# Altium project STM32F746_AppBoard.PrjPCB (part 1 of 2)
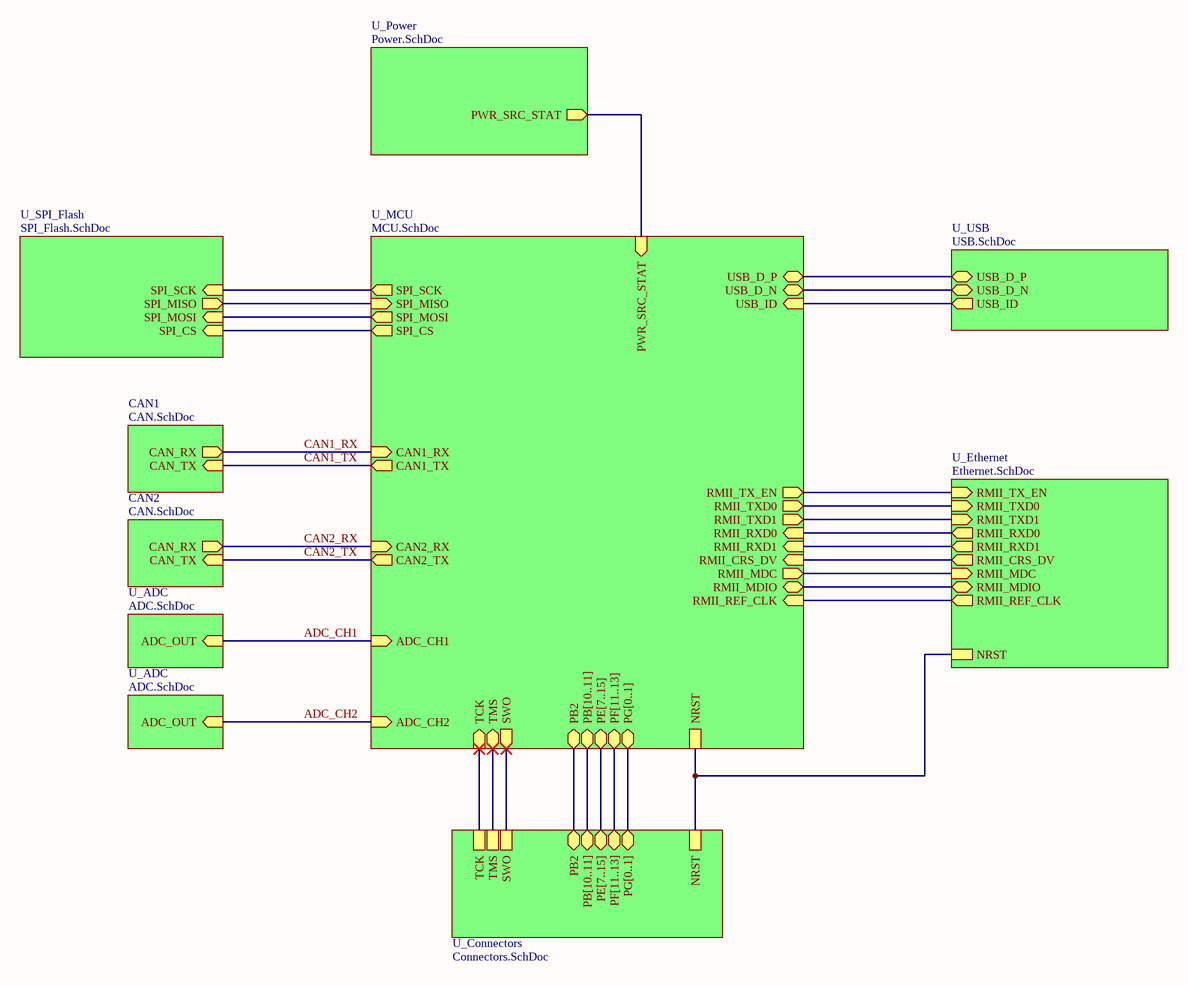
[diagram p0: Top.SchDoc]
9 sheets, 187 parts. Net scope: hierarchical (ports join the sheet entries above them; power ports are global).
Board file: STM32F746_AppBoard.PcbDoc
Sheets:
  Top.SchDoc
    U_Connectors = Connectors.SchDoc
    U_Ethernet = Ethernet.SchDoc
    U_MCU = MCU.SchDoc
    U_USB = USB.SchDoc
    U_SPI_Flash = SPI_Flash.SchDoc
    U_Power = Power.SchDoc
    CAN1 = CAN.SchDoc
    CAN2 = CAN.SchDoc
    U_ADC = ADC.SchDoc
    U_ADC = ADC.SchDoc

## Sheet Top.SchDoc: Top
size 431 x 279 mm; Author: Alberto Marrone, Christian Schmitz, Leo Walter; DrawnBy: Alberto Marrone, Christian Schmitz, Leo Walter; Engineer: Alberto Marrone, Christian Schmitz, Leo Walter; Revision: V1.0; SheetNumber: 1; Project: PCB Design Final Project

### Sub-sheets
CAN1 = CAN.SchDoc: CAN_TX (in), CAN_RX (out)
CAN2 = CAN.SchDoc: CAN_TX (in), CAN_RX (out)
U_ADC = ADC.SchDoc: ADC_OUT (in)
U_ADC = ADC.SchDoc: ADC_OUT (in)
U_Connectors = Connectors.SchDoc: PF[11..13] (bidir), PB[10..11] (bidir), PE[7..15] (bidir), TCK, TMS, SWO, NRST, PB2 (bidir), PG[0..1] (bidir)
U_Ethernet = Ethernet.SchDoc: RMII_TXD0 (in), RMII_TX_EN (in), RMII_RXD0 (out), RMII_REF_CLK (out), RMII_CRS_DV (out), RMII_MDC (in), RMII_MDIO (bidir), NRST, RMII_TXD1 (in), RMII_RXD1 (out)
U_MCU = MCU.SchDoc: RMII_TXD0 (out), RMII_TX_EN (out), RMII_RXD0 (in), RMII_REF_CLK (in), RMII_CRS_DV (in), RMII_MDC (out), RMII_MDIO (bidir), RMII_TXD1 (out), RMII_RXD1 (in), SPI_SCK (out), SPI_MOSI (out), SPI_CS (out), SPI_MISO (in), USB_ID (in), PWR_SRC_STAT (in), CAN2_RX (in), CAN2_TX (out), SWO (out), TMS (bidir), TCK (in), NRST, USB_D_N (bidir), USB_D_P (bidir), CAN1_TX (out), CAN1_RX (in), ADC_CH1 (in), ADC_CH2 (in), PB2 (bidir), PB[10..11] (bidir), PF[11..13] (bidir), PE[7..15] (bidir), PG[0..1] (bidir)
U_Power = Power.SchDoc: PWR_SRC_STAT (out)
U_SPI_Flash = SPI_Flash.SchDoc: SPI_SCK (in), SPI_MOSI (in), SPI_MISO (out), SPI_CS (in)
U_USB = USB.SchDoc: USB_ID (out), USB_D_N (bidir), USB_D_P (bidir)

### Nets
ADC_CH1: sheet U_MCU/ADC_CH1, sheet U_ADC/ADC_OUT
ADC_CH2: sheet U_MCU/ADC_CH2, sheet U_ADC/ADC_OUT
CAN1_RX: sheet U_MCU/CAN1_RX, sheet CAN1/CAN_RX
CAN1_TX: sheet U_MCU/CAN1_TX, sheet CAN1/CAN_TX
CAN2_RX: sheet U_MCU/CAN2_RX, sheet CAN2/CAN_RX
CAN2_TX: sheet U_MCU/CAN2_TX, sheet CAN2/CAN_TX
NRST: sheet U_Connectors/NRST, sheet U_Ethernet/NRST, sheet U_MCU/NRST
PB2: sheet U_Connectors/PB2, sheet U_MCU/PB2
USB_D_N: sheet U_MCU/USB_D_N, sheet U_USB/USB_D_N
USB_D_P: sheet U_MCU/USB_D_P, sheet U_USB/USB_D_P
NetCN1_4: sheet U_MCU/USB_ID, sheet U_USB/USB_ID
NetP1_2: sheet U_Connectors/TMS, sheet U_MCU/TMS
NetP1_4: sheet U_Connectors/TCK, sheet U_MCU/TCK
NetP1_7: sheet U_Connectors/SWO, sheet U_MCU/SWO
NetR15_2: sheet U_Ethernet/RMII_RXD0, sheet U_MCU/RMII_RXD0
NetR16_2: sheet U_Ethernet/RMII_RXD1, sheet U_MCU/RMII_RXD1
NetR23_2: sheet U_Ethernet/RMII_CRS_DV, sheet U_MCU/RMII_CRS_DV
NetR24_1: sheet U_Ethernet/RMII_MDIO, sheet U_MCU/RMII_MDIO
NetR29_2: sheet U_Ethernet/RMII_REF_CLK, sheet U_MCU/RMII_REF_CLK
NetR50_2: sheet U_MCU/PWR_SRC_STAT, sheet U_Power/PWR_SRC_STAT
NetU1_1: sheet U_MCU/SPI_SCK, sheet U_SPI_Flash/SPI_SCK
NetU1_3: sheet U_MCU/SPI_CS, sheet U_SPI_Flash/SPI_CS
NetU1_4: sheet U_MCU/SPI_MISO, sheet U_SPI_Flash/SPI_MISO
NetU1_5: sheet U_MCU/SPI_MOSI, sheet U_SPI_Flash/SPI_MOSI
NetU1_27: sheet U_Ethernet/RMII_MDC, sheet U_MCU/RMII_MDC
NetU1_74: sheet U_Ethernet/RMII_TXD1, sheet U_MCU/RMII_TXD1
NetU1_126: sheet U_Ethernet/RMII_TX_EN, sheet U_MCU/RMII_TX_EN
NetU1_128: sheet U_Ethernet/RMII_TXD0, sheet U_MCU/RMII_TXD0

### Buses and harness runs
bus sheet U_Connectors/PB[10..11] = sheet U_MCU/PB[10..11]
bus sheet U_Connectors/PE[7..15] = sheet U_MCU/PE[7..15]
bus sheet U_Connectors/PF[11..13] = sheet U_MCU/PF[11..13]
bus sheet U_Connectors/PG[0..1] = sheet U_MCU/PG[0..1]

### Notes on the sheet
- DWG. NO.
- REV.
- SHT.
- THIS DOCUMENT AND THE DATA DISCLOSED HEREIN OR HEREWITH IS THE PROPERTY OF ALTIUM LIMITED AND MAY BE FREELY DISTRIBUTED IN WHOLE. NO RIGHTS ARE RESERVED OR EXPRESS OR IMPLIED WARANTEE GIVEN.
- REVISION
- DESCRIPTION
- DATE
- APPROVED
- ENG:
- APPROVALS
- PROJECT
- DSN:
- CHK:
- REFERENCE DOCUMENTS
- PROJECT REVISION:
- TITLE
- DOCUMENT REVISION:
- DESIGN ITEM:
- BOM:
- FAB DWG:
- PCB DWG:
- ASSY DWG:
- SCALE:
- SIZE
- B
- CAGE CODE
- FILE NAME
- DWG NO.
- SHEET
- OF
- REV

## Sheet Connectors.SchDoc: Connectors
size 431 x 279 mm; Author: Alberto Marrone, Christian Schmitz, Leo Walter; DrawnBy: Alberto Marrone, Christian Schmitz, Leo Walter; Engineer: Alberto Marrone, Christian Schmitz, Leo Walter; Revision: V1.0; SheetNumber: 8; Project: PCB Design Final Project
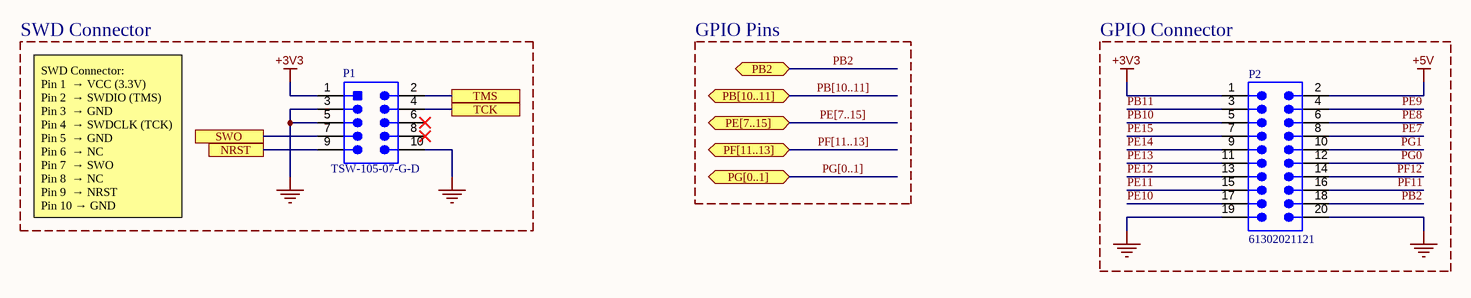
[diagram p1: Connectors.SchDoc]

### Parts
P1  TSW-105-07-G-D  [SMTC-TSW-105-07-G-D_V]
P2  61302021121  [61302021121]

### Blocks framed on the sheet
SWD Connector: P1
GPIO Connector: P2

### Ports
NRST, PB2 (bidir), PB[10..11] (bidir), PE[7..15] (bidir), PF[11..13] (bidir), PG[0..1] (bidir), SWO, TCK, TMS

### Nets
+3V3: P1.1 P2.1
+5V: P2.2
GND: P1.3 P1.5 P1.10 P2.19 P2.20
NRST: P1.9 ; port NRST
PB2: P2.18 ; port PB2
PB10: P2.5
PB11: P2.3
PE7: P2.8
PE8: P2.6
PE9: P2.4
PE10: P2.17
PE11: P2.15
PE12: P2.13
PE13: P2.11
PE14: P2.9
PE15: P2.7
PF11: P2.16
PF12: P2.14
PG0: P2.12
PG1: P2.10
NetP1_2: P1.2 ; port TMS
NetP1_4: P1.4 ; port TCK
NetP1_7: P1.7 ; port SWO

Not connected (* = marked no-connect by the designer): P1 6* 8*

### Buses and harness runs
bus PB[10..11] = port PB[10..11]
bus PE[7..15] = port PE[7..15]
bus PF[11..13] = port PF[11..13]
bus PG[0..1] = port PG[0..1]

### Notes on the sheet
- GPIO Pins
- SWD Connector:
  Pin 1  → VCC (3.3V)
  Pin 2  → SWDIO (TMS)
  Pin 3  → GND
  Pin 4  → SWDCLK (TCK)
  Pin 5  → GND
  Pin 6  → NC
  Pin 7  → SWO
  Pin 8  → NC
  Pin 9  → NRST
  Pin 10 → GND
- DWG. NO.
- REV.
- SHT.
- THIS DOCUMENT AND THE DATA DISCLOSED HEREIN OR HEREWITH IS THE PROPERTY OF ALTIUM LIMITED AND MAY BE FREELY DISTRIBUTED IN WHOLE. NO RIGHTS ARE RESERVED OR EXPRESS OR IMPLIED WARANTEE GIVEN.
- REVISION
- DESCRIPTION
- DATE
- APPROVED
- ENG:
- APPROVALS
- PROJECT
- DSN:
- CHK:
- REFERENCE DOCUMENTS
- PROJECT REVISION:
- TITLE
- DOCUMENT REVISION:
- DESIGN ITEM:
- BOM:
- FAB DWG:
- PCB DWG:
- ASSY DWG:
- SCALE:
- SIZE
- B
- CAGE CODE
- FILE NAME
- DWG NO.
- SHEET
- OF
- REV

### Library data of the parts
P1 = CMP-2000-07330-1: Post Terminal Strip Assembly, Pitch 2.54 mm, 2 x 5 Position, Height 8.58 mm, Tail Length 2.54 mm, -55 to 125 degC, RoHS, Bulk; Manufacturer: Samtec-Inc.; Connector Type: Header,Unshrouded; Number of Positions Loaded: All; Pitch: 0.100"(2.54mm); Number of Positions: 10; Package Reference: TSW-105-07-G-D; Mounting Technology: ThroughHole; Datasheet URL: http://suddendocs.samtec.com/prints/tsw-xxx-xx-xxx-x-xx-xxx-mkt.pdf; Termination: Solder; Packaging: Bulk; Number of Rows: 2; Contact Finish: Gold; Mounting Type: ThroughHole; Features: -; Color: Black; Category: Connectors,Interconnects; Family: RectangularConnectors-Headers,MalePins; Manufacturer URL: http://www.samtec.com/; Series: TSW; Fastening Type: -; Package URL: http://suddendocs.samtec.com/prints/tsw-xxx-xx-x-x-xx-xxx-footprint.pdf; Row Spacing: 0.100"(2.54mm); Contact Mating Length: 0.230"(5.84mm); Contact Finish Thickness: 10µin(0.25µm); Contact Type: MalePin; Package Description: Male Header, Pitch 2.54 mm, 2 x 5 Position, Height 8.58 mm, Tail Length 2.54 mm; Datasheet Version: Rev. DO, 08/1988
P2 = CMP-1502-01104-4: THT Vertical Pin Header WR-PHD, Pitch 2.54 mm, Dual Row, 20 pins; Connector Type: Male Pin; Current Rating: 3A; Number of Contacts: 20; Gender: Male; Contact Resistance: 20mΩ; Pitch: 2.54mm; Operating Supply Voltage: 250V; Color: Black; Contact Mating Length: 5.9944mm; Termination: Solder; Packaging: Bulk; Lead Pitch: 2.54mm; Height: 8.89mm; Orientation: Vertical; Min Operating Temperature: -40°C; Max Operating Temperature: 105°C; Number of Positions: 20; Mount: Through Hole; RoHS: Compliant; Number of Pins: 20; Voltage Rating: 250V; Number of Rows: 2; Contact Plating: Gold; Row Spacing: 2.54mm; Contact Material: Gold

## Sheet Ethernet.SchDoc: Ethernet
size 431 x 279 mm; Author: Alberto Marrone, Christian Schmitz, Leo Walter; DrawnBy: Alberto Marrone, Christian Schmitz, Leo Walter; Engineer: Alberto Marrone, Christian Schmitz, Leo Walter; Revision: V1.0; SheetNumber: 7; Project: PCB Design Final Project
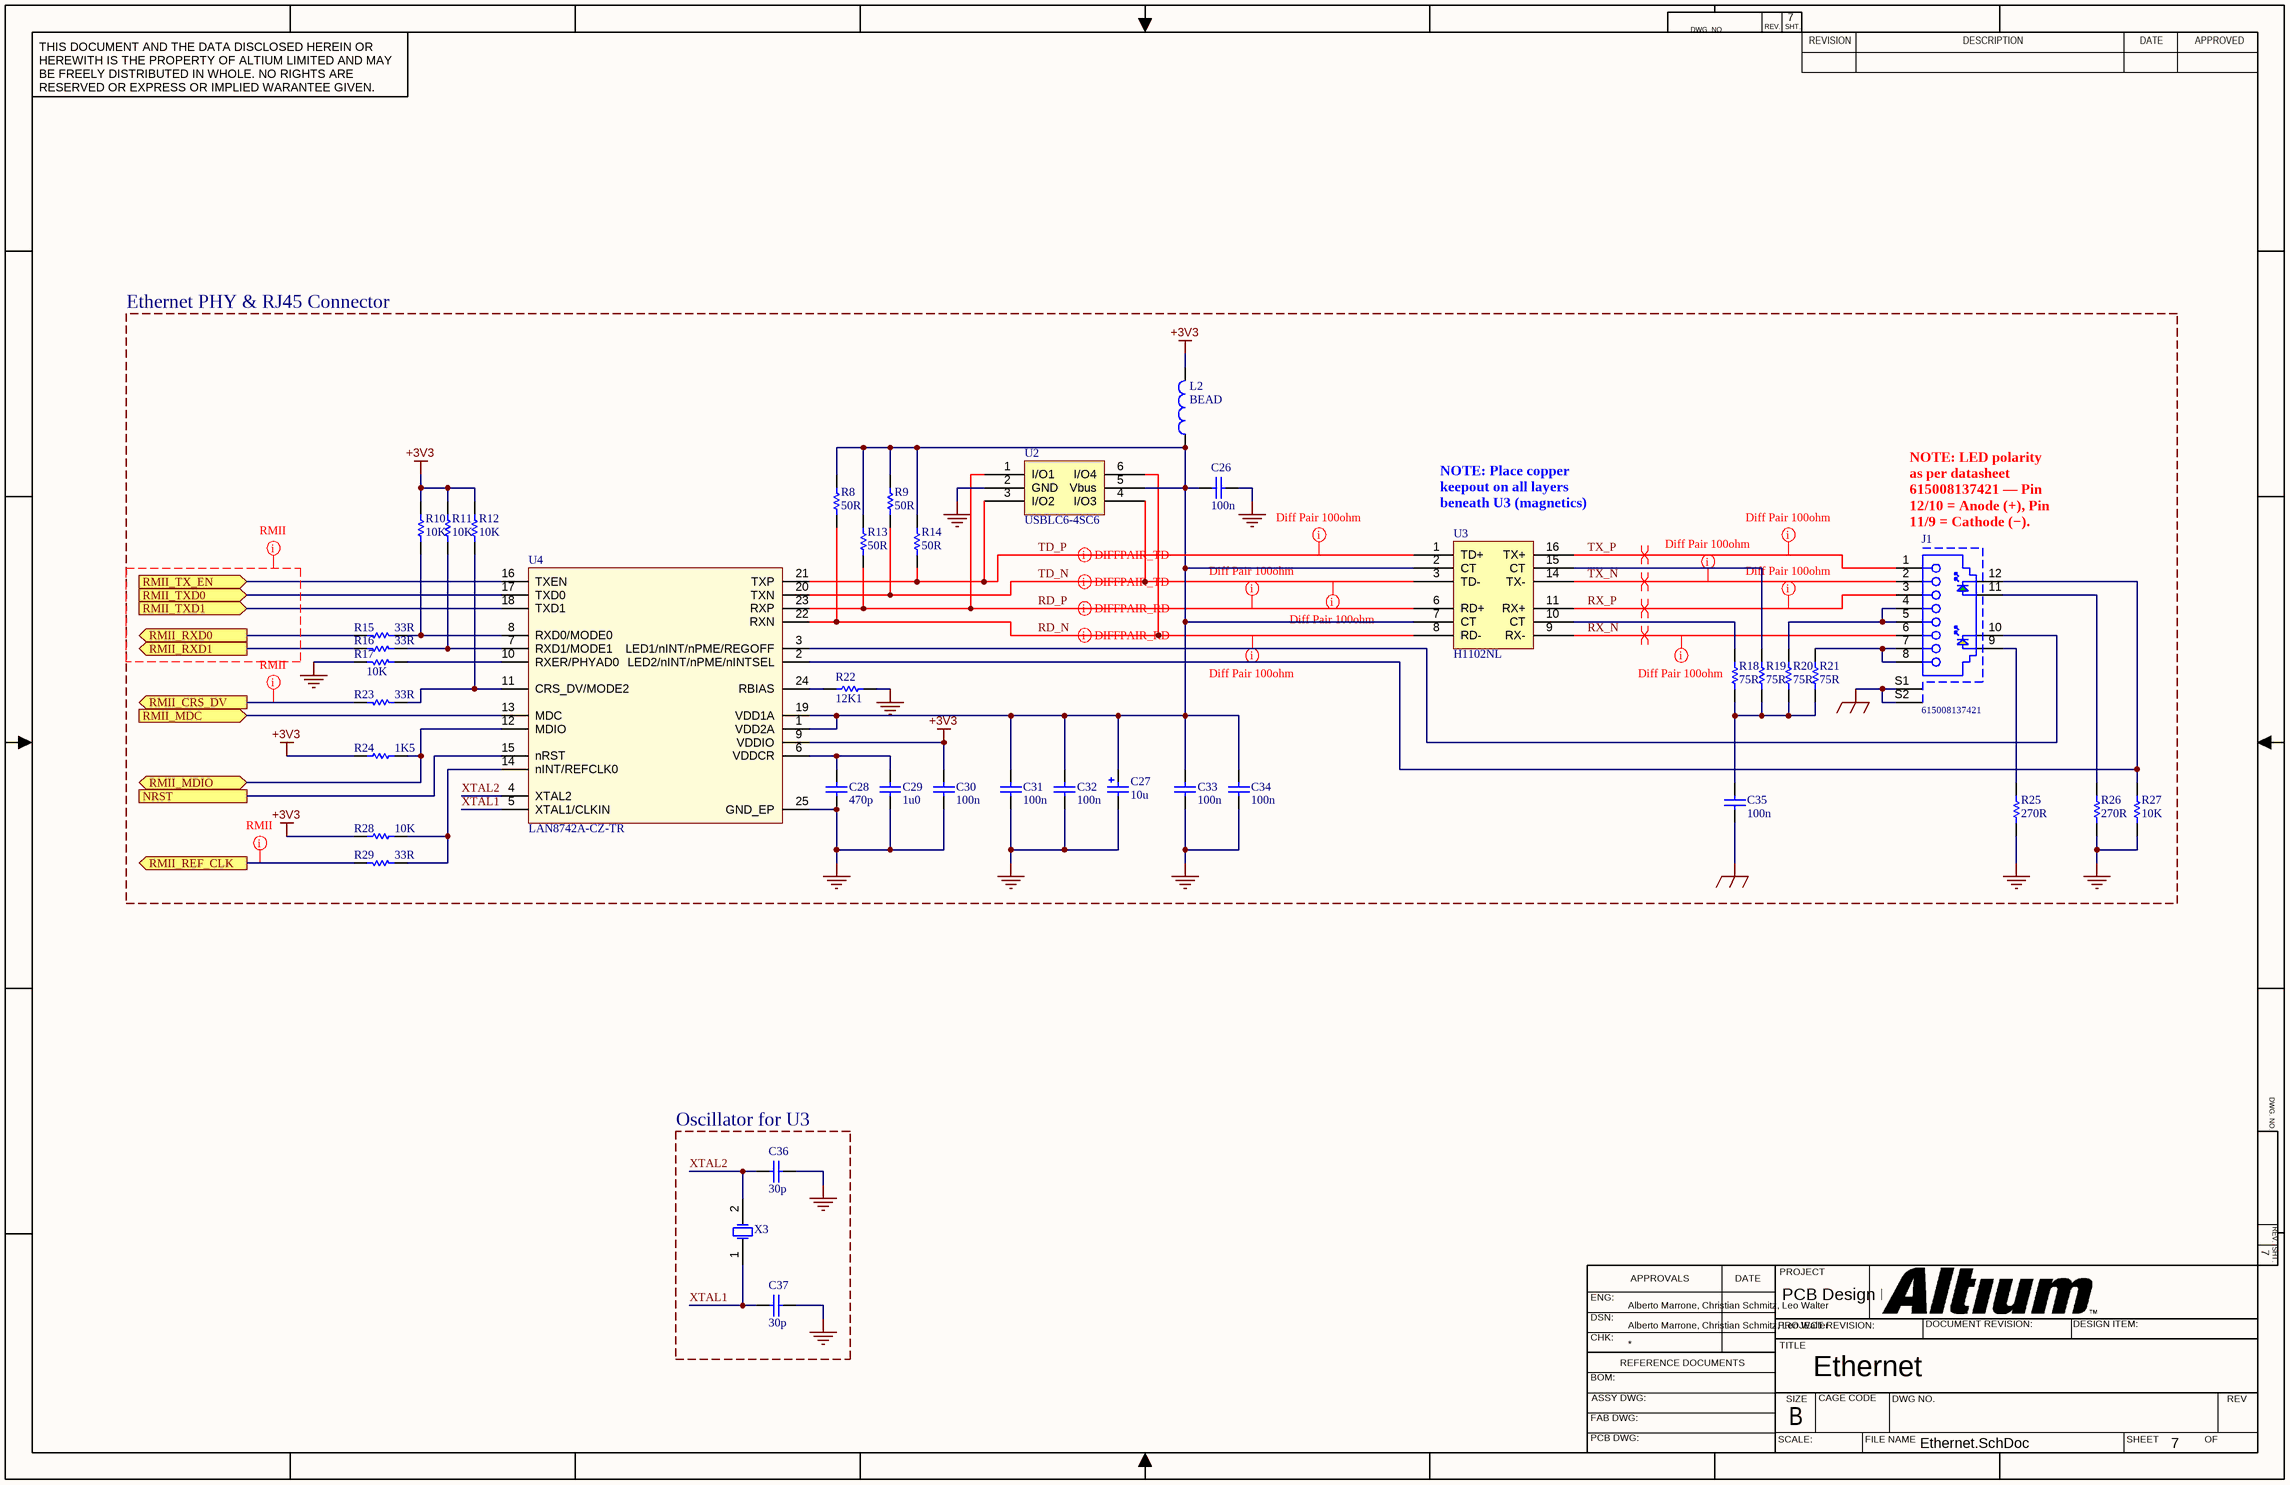
[diagram p2: Ethernet.SchDoc]

### Parts
C26  100n  [0603C]
C27  10u  [TAN-B]
C28  470p  [0603C]
C29  1u0  [0603C]
C30  100n  [0603C]
C31  100n  [0603C]
C32  100n  [0603C]
C33  100n  [0603C]
C34  100n  [0603C]
C35  100n  [0603C]
C36  30p  [0603C]
C37  30p  [0603C]
J1  615008137421  [615008137421]
L2  BEAD  [0603L]
R8  50R  [0603R]
R9  50R  [0603R]
R10  10K  [0603R]
R11  10K  [0603R]
R12  10K  [0603R]
R13  50R  [0603R]
R14  50R  [0603R]
R15  33R  [0603R]
R16  33R  [0603R]
R17  10K  [0603R]
R18  75R  [0603R]
R19  75R  [0603R]
R20  75R  [0603R]
R21  75R  [0603R]
R22  12K1  [0603R]
R23  33R  [0603R]
R24  1K5  [0603R]
R25  270R  [0603R]
R26  270R  [0603R]
R27  10K  [0603R]
R28  10K  [0603R]
R29  33R  [0603R]
U2  USBLC6-4SC6  [SOT23-6L]
U3  H1102NL  [Transformer]
U4  LAN8742A-CZ-TR  [QFN24_0R5_4X4]
X3  ECS-250-12-30Q-JES-TR  [XTAL_2SM_5R0X3R2]  (value not drawn)

### Blocks framed on the sheet
Ethernet PHY & RJ45 Connector: C26-C35 J1 L2 R8-R29 U2-U4
Oscillator for U3: C36 C37 X3

### Ports
NRST, RMII_CRS_DV (out), RMII_MDC (in), RMII_MDIO (bidir), RMII_REF_CLK (out), RMII_RXD0 (out), RMII_RXD1 (out), RMII_TX_EN (in), RMII_TXD0 (in), RMII_TXD1 (in)

### Nets
+3V3: C30.2 L2.2 R10.1 R11.1 R12.1 R24.2 R28.1 U4.9(VDDIO)
EGND: C35.1 J1.S1 J1.S2
GND: C26.1 C27.2 C28.1 C29.2 C30.1 C31.1 C32.1 C33.1 C34.1 C36.2 C37.2 R17.2 R22.2 R25.2 R26.2 R27.2 U2.2(GND) U4.25(GND_EP)
NRST: U4.15(nRST) ; port NRST
RD_N: R8.1 U2.6(I/O4) U3.8(RD-) U4.22(RXN)
RD_P: R13.1 U2.1(I/O1) U3.6(RD+) U4.23(RXP)
RX_N: J1.6 U3.9(RX-)
RX_P: J1.3 U3.11(RX+)
TD_N: R9.1 U2.4(I/O3) U3.3(TD-) U4.20(TXN)
TD_P: R14.1 U2.3(I/O2) U3.1(TD+) U4.21(TXP)
TX_N: J1.2 U3.14(TX-)
TX_P: J1.1 U3.16(TX+)
XTAL1: C37.1 U4.5(XTAL1/CLKIN) X3.1(OSC1)
XTAL2: C36.1 U4.4(XTAL2) X3.2(OSC2)
NetC26_2: C26.2 C27.1 C31.2 C32.2 C33.2 C34.2 L2.1 R8.2 R9.2 R13.2 R14.2 U2.5(Vbus) U3.2(CT) U3.7(CT) U4.1(VDD2A) U4.19(VDD1A)
NetC28_2: C28.2 C29.1 U4.6(VDDCR)
NetC35_2: C35.2 R18.1 R19.1 R20.1 R21.1
NetJ1_4: J1.4 J1.5 R20.2
NetJ1_7: J1.7 J1.8 R21.2
NetJ1_9: J1.9 R25.1
NetJ1_10: J1.10 U4.3(LED1/nINT/nPME/REGOFF)
NetJ1_11: J1.11 R26.1
NetJ1_12: J1.12 R27.1 U4.2(LED2/nINT/nPME/nINTSEL)
NetR10_2: R10.2 R15.1 U4.8(RXD0/MODE0)
NetR11_2: R11.2 R16.1 U4.7(RXD1/MODE1)
NetR12_2: R12.2 R23.1 U4.11(CRS_DV/MODE2)
NetR15_2: R15.2 ; port RMII_RXD0
NetR16_2: R16.2 ; port RMII_RXD1
NetR17_1: R17.1 U4.10(RXER/PHYAD0)
NetR18_2: R18.2 U3.10(CT)
NetR19_2: R19.2 U3.15(CT)
NetR22_1: R22.1 U4.24(RBIAS)
NetR23_2: R23.2 ; port RMII_CRS_DV
NetR24_1: R24.1 U4.12(MDIO) ; port RMII_MDIO
NetR28_2: R28.2 R29.1 U4.14(nINT/REFCLK0)
NetR29_2: R29.2 ; port RMII_REF_CLK
NetU1_27: U4.13(MDC) ; port RMII_MDC
NetU1_74: U4.18(TXD1) ; port RMII_TXD1
NetU1_126: U4.16(TXEN) ; port RMII_TX_EN
NetU1_128: U4.17(TXD0) ; port RMII_TXD0

### Layout directives
differential pair: RD_N, RD_P, RX_N, RX_P, TD_N, TD_P, TX_N, TX_P
net class ETH_Diff: RD_N, RD_P, RX_N, RX_P, TD_N, TD_P, TX_N, TX_P
net class RMII: (no net found under the mark), NetR23_2, NetR29_2

### Notes on the sheet
- (near U3) NOTE: Place copper keepout on all layers beneath U3 (magnetics)
- (near J1) NOTE: LED polarity as per datasheet 615008137421 — Pin 12/10 = Anode (+), Pin 11/9 = Cathode (−). Symbol shows reversed polarity.
- DWG. NO.
- REV.
- SHT.
- THIS DOCUMENT AND THE DATA DISCLOSED HEREIN OR HEREWITH IS THE PROPERTY OF ALTIUM LIMITED AND MAY BE FREELY DISTRIBUTED IN WHOLE. NO RIGHTS ARE RESERVED OR EXPRESS OR IMPLIED WARANTEE GIVEN.
- REVISION
- DESCRIPTION
- DATE
- APPROVED
- ENG:
- APPROVALS
- PROJECT
- DSN:
- CHK:
- REFERENCE DOCUMENTS
- PROJECT REVISION:
- TITLE
- DOCUMENT REVISION:
- DESIGN ITEM:
- BOM:
- FAB DWG:
- PCB DWG:
- ASSY DWG:
- SCALE:
- SIZE
- B
- CAGE CODE
- FILE NAME
- DWG NO.
- SHEET
- OF
- REV

### Library data of the parts
C26 C30-C35 = Cap: Capacitor; Dielectric: X7R; Published: 8-Jun-2000; Revision: July-2002: Re-released for DXP Platform.; Publisher: Altium Limited; Value: 100n
C27 = Cap Pol1: Tantalum Capacitor; Voltage Rating: 25V; Published: 8-Jun-2000; Revision: July-2002: Re-released for DXP Platform.; Publisher: Altium Limited; Value: 10u
C28 C36 C37 = Capacitor_ST: Capacitor 0402 / 0603 / 0805; Revision: July-2002: Re-released for DXP Platform.
  C28: Value: 470p
  C36 C37: Value: 30p
C29 = CAP SMD 0603  X5R 1µF 25V 10%: Capacitor; Voltage Rating: 25V; Tolerance: 10%; Dielectric: X5R; Manufacturer: *; Manufacturer P/N: *; Order code Farnell: 1288202RL; Value: 1u0; Power: *; Temperature  Factor: *; Temperature Max: +125°C; Temperature Min: -55°C; STS Code: *
J1 = CMP-1502-01697-1: Modular Jack WR-MJ, Tab Up, Shielded, with LED and EMI Panel Finger, Horizontal Entry, THT, 8P8C; Manufacturer: Wurth Elektronik; Compliance: Leadfree/RoHS; Withstanding Voltage: 1000VAC; Port: 1x1; Contact Resistance: 20mOhm; Rated Current: 1.5A; Working Voltage: 120VAC; Manufacturer URL: http://www.we-online.de; Mounting Technology: THT; Entrance: Horizontal; Datasheet URL: https://katalog.we-online.de/em/datasheet/615008137421.pdf; Packaging: Tray; Package Reference: 615008137421; Publisher: WurthElektronik; Operating Temperature: -40to85degC; Part Number: 615008137421; Pin Number: 8P8C
L2 = Inductor: Value: 100uH; Published: 8-Jun-2000; Revision: July-2002: Re-released for DXP Platform.; Publisher: Altium Limited
R8 R9 R13 R14 = Res_50_1%_0603: Resistor,50,0603,1%,YAGEO; Manuf_Part_1: RC0402FR-0750RL; Value: 50R; Manuf_1: YAGEO; Order: *; ECCN_US/EU: n/a; Distrib: FARNELL
R10-R12 R17 R27 R28 = res1: Resistor; Published: 8-Jun-2000; Revision: July-2002: Re-released for DXP Platform.; Publisher: Altium Limited; Value: 10K
R15 R16 R23 R29 = res1: Resistor; Tolerance: 1%; Published: 8-Jun-2000; Revision: July-2002: Re-released for DXP Platform.; Publisher: Altium Limited; Value: 33R
R18-R21 = Res_75_1%_0603: Resistor; Manuf_Part_1: RC0402FR-0750RL; Manuf_1: YAGEO; Tolerance: 1%; Value: 75R; Order: *; ECCN_US/EU: n/a; Distrib: FARNELL
R22 = Res_12K1_1%_0603: Resistor,12K1,0603,1%,VISHAY; Manuf_Part_1: MCT 0603-50 1% P5 12K1; Order: 2325243; Value: 12K1; ECCN_US/EU: n/a; Manuf_1: VISHAY; Distrib: FARNELL
R24 = Res_1K5_1%_0402: Resistor,1K5,0402,1%,YAGEO; Manuf_Part_1: RC0402FR-071K5L; Value: 1K5; Manuf_1: YAGEO; Order: RC0402FR-071K5L; ECCN_US/EU: n/a; Distrib: FARNELL
R25 R26 = Resistor_ST: Resistor 0402 / 0603 / 0805; Value: 270R
U3 = KMS-1102NL: replaces the KMS-1102NL
U4 = LAN8742A-CZ-TR: LAN8742A-CZ-TR - Small Footprint RMII 10/100 Ethernet, Transceiver with HP Auto-MDIX and flexPWR Technology SQFN-24; Manuf_1: MICROCHIP; Order: LAN8742A-CZ-TR; Manuf_Part_1: LAN8742A-CZ-TR; Distrib: MICROCHIP; Supplier 1: Farnell; Supplier Part Number 1: LAN8742A-CZ-TR
X3 = XTAL_5032: Crystal Oscillator; Published: 8-Jun-2000; LatestRevisionDate: 17-Jul-2002; LatestRevisionNote: Re-released for DXP Platform.; PackageReference: R38; Publisher: Altium Limited

## Sheet MCU.SchDoc: MCU
size 431 x 279 mm; Author: Alberto Marrone, Christian Schmitz, Leo Walter; DrawnBy: Alberto Marrone, Christian Schmitz, Leo Walter; Engineer: Alberto Marrone, Christian Schmitz, Leo Walter; Revision: V1.0; SheetNumber: 5; Project: PCB Design Final Project
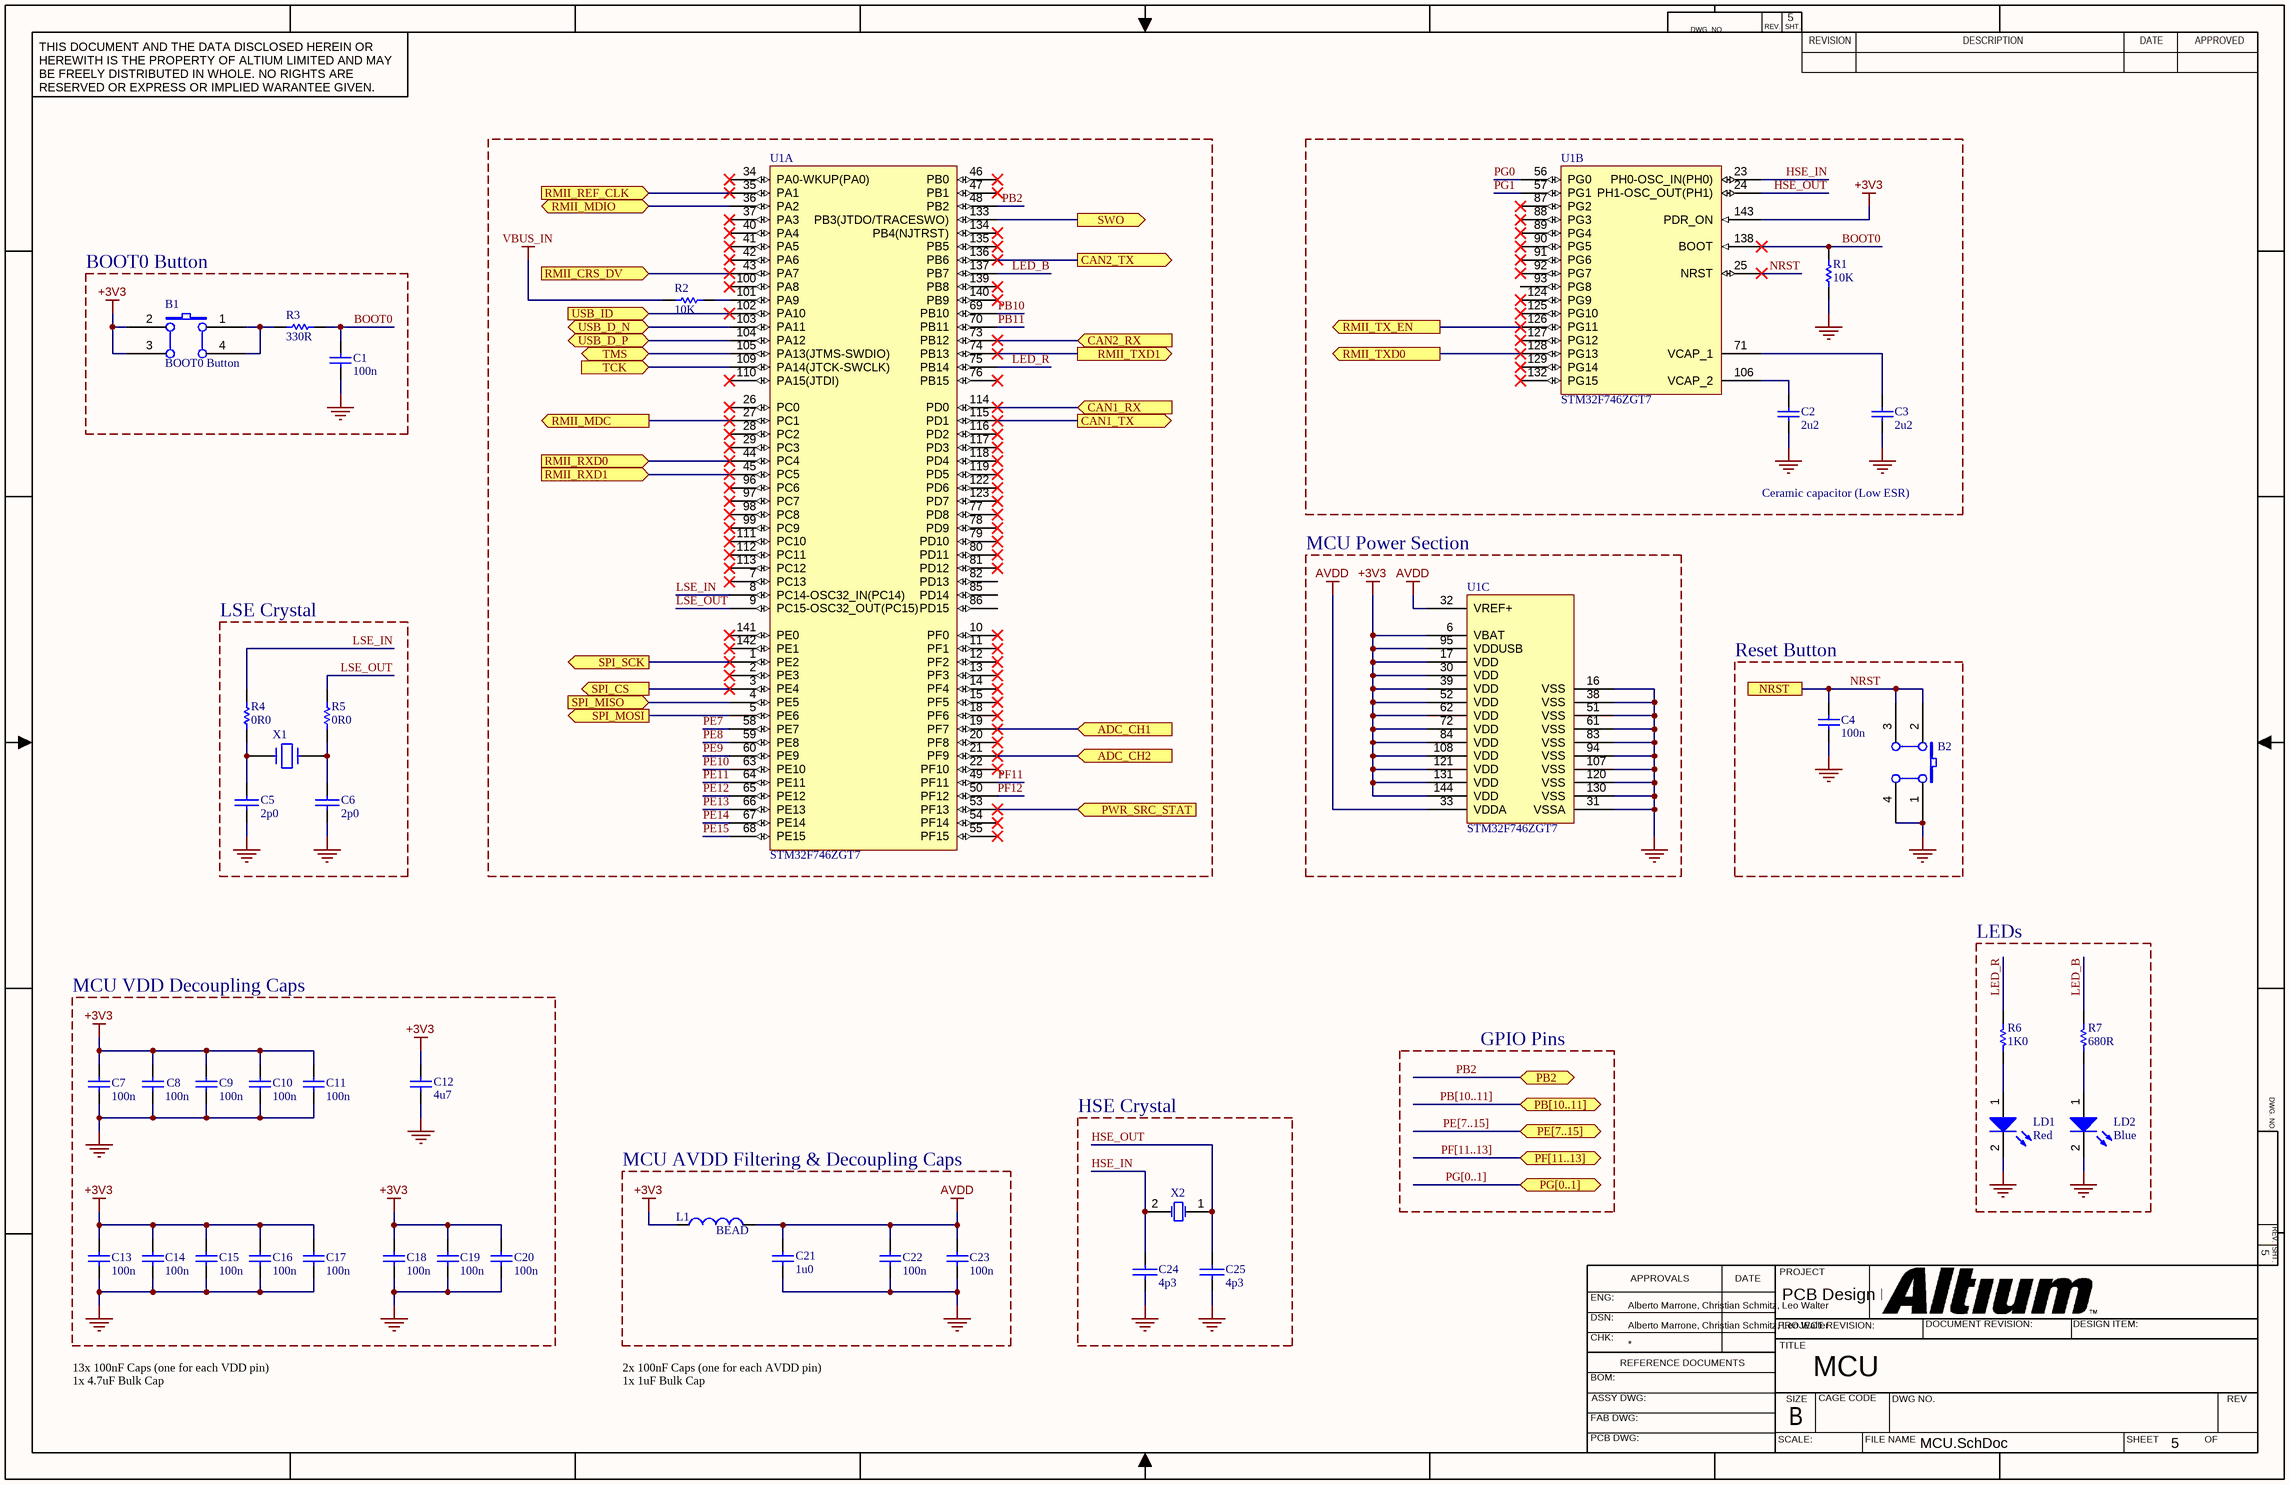
[diagram p3: MCU.SchDoc]

### Parts
B1  BOOT0 Button  [PB-6X6mm-Blue]
B2  TS40-66-33-BK-160-SMT-TR  [PB-6X6mm-Black]  (value not drawn)
C1  100n  [0603C]
C2  2u2  [TAN-A]
C3  2u2  [TAN-A]
C4  100n  [0603C]
C5  2p0  [0603C]
C6  2p0  [0603C]
C7  100n  [0603C]
C8  100n  [0603C]
C9  100n  [0603C]
C10  100n  [0603C]
C11  100n  [0603C]
C12  4u7  [0603C]
C13  100n  [0603C]
C14  100n  [0603C]
C15  100n  [0603C]
C16  100n  [0603C]
C17  100n  [0603C]
C18  100n  [0603C]
C19  100n  [0603C]
C20  100n  [0603C]
C21  1u0  [0603C]
C22  100n  [0603C]
C23  100n  [0603C]
C24  4p3  [0603C]
C25  4p3  [0603C]
L1  BEAD  [0603L]
LD1  Red  [0603D-R]
LD2  Blue  [0603D-B]
R1  10K  [0603R]
R2  10K  [0603R]
R3  330R  [0603R]
R4  0R0  [0603R]
R5  0R0  [0603R]
R6  1K0  [0603R]
R7  680R  [0603R]
U1  STM32F746ZGT7  [STM-LQFP144_M]  (parts A,B,C of 3)
X1  ABS07-120-32.768KHZ-T  [XTAL_2SM_3R2X1R5]  (value not drawn)
X2  ABM8AAIG-8.000MHz-V2R-T3  [OSC_2SM_3R2x2R5]  (value not drawn)

### Blocks framed on the sheet
Ceramic capacitor (Low ESR): C2 C3 R1 U1
BOOT0 Button: B1 C1 R3
MCU Power Section: U1
LSE Crystal: C5 C6 R4 R5 X1
Reset Button: B2 C4
LEDs: LD1 LD2 R6 R7
MCU VDD Decoupling Caps: C7-C20
HSE Crystal: C24 C25 X2
MCU AVDD Filtering & Decoupling Caps: C21-C23 L1

### Ports
ADC_CH1 (in), ADC_CH2 (in), CAN1_RX (in), CAN1_TX (out), CAN2_RX (in), CAN2_TX (out), NRST, PB2 (bidir), PB[10..11] (bidir), PE[7..15] (bidir), PF[11..13] (bidir), PG[0..1] (bidir), PWR_SRC_STAT (in), RMII_CRS_DV (in), RMII_MDC (out), RMII_MDIO (bidir), RMII_REF_CLK (in), RMII_RXD0 (in), RMII_RXD1 (in), RMII_TX_EN (out), RMII_TXD0 (out), RMII_TXD1 (out), SPI_CS (out), SPI_MISO (in), SPI_MOSI (out), SPI_SCK (out), SWO (out), TCK (in), TMS (bidir), USB_D_N (bidir), USB_D_P (bidir), USB_ID (in)

### Nets
+3V3: B1.2(B0) B1.3(B1) C7.1 C8.1 C9.1 C10.1 C11.1 C12.1 C13.1 C14.1 C15.1 C16.1 C17.1 C18.1 C19.1 C20.1 L1.1 U1.6(VBAT) U1.17(VDD) U1.30(VDD) U1.39(VDD) U1.52(VDD) U1.62(VDD) U1.72(VDD) U1.84(VDD) U1.95(VDDUSB) U1.108(VDD) U1.121(VDD) U1.131(VDD) U1.143(PDR_ON) U1.144(VDD)
AVDD: C21.1 C22.1 C23.1 L1.2 U1.32(VREF+) U1.33(VDDA)
GND: B2.1(A0) B2.4(A1) C1.1 C2.2 C3.2 C4.1 C5.2 C6.2 C7.2 C8.2 C9.2 C10.2 C11.2 C12.2 C13.2 C14.2 C15.2 C16.2 C17.2 C18.2 C19.2 C20.2 C21.2 C22.2 C23.2 C24.2 C25.2 LD1.2(K) LD2.2(K) R1.2 U1.16(VSS) U1.31(VSSA) U1.38(VSS) U1.51(VSS) U1.61(VSS) U1.83(VSS) U1.94(VSS) U1.107(VSS) U1.120(VSS) U1.130(VSS)
VBUS_IN: R2.1
ADC_CH1: U1.19(PF7) ; port ADC_CH1
ADC_CH2: U1.21(PF9) ; port ADC_CH2
BOOT0: C1.2 R1.1 R3.2 U1.138(BOOT)
CAN1_RX: U1.114(PD0) ; port CAN1_RX
CAN1_TX: U1.115(PD1) ; port CAN1_TX
CAN2_RX: U1.73(PB12) ; port CAN2_RX
CAN2_TX: U1.136(PB6) ; port CAN2_TX
HSE_IN: C24.1 U1.23(PH0-OSC_IN(PH0)) X2.2(OSC2)
HSE_OUT: C25.1 U1.24(PH1-OSC_OUT(PH1)) X2.1(OSC1)
LED_B: R7.1 U1.137(PB7)
LED_R: R6.1 U1.75(PB14)
LSE_IN: R4.2 U1.8(PC14-OSC32_IN(PC14))
LSE_OUT: R5.2 U1.9(PC15-OSC32_OUT(PC15))
NRST: B2.2(B0) B2.3(B1) C4.2 U1.25(NRST) ; port NRST
PB2: U1.48(PB2) ; port PB2
PB10: U1.69(PB10)
PB11: U1.70(PB11)
PE7: U1.58(PE7)
PE8: U1.59(PE8)
PE9: U1.60(PE9)
PE10: U1.63(PE10)
PE11: U1.64(PE11)
PE12: U1.65(PE12)
PE13: U1.66(PE13)
PE14: U1.67(PE14)
PE15: U1.68(PE15)
PF11: U1.49(PF11)
PF12: U1.50(PF12)
PG0: U1.56(PG0)
PG1: U1.57(PG1)
USB_D_N: U1.103(PA11) ; port USB_D_N
USB_D_P: U1.104(PA12) ; port USB_D_P
NetB1_1: B1.1(A0) B1.4(A1) R3.1
NetC2_1: C2.1 U1.106(VCAP_2)
NetC3_1: C3.1 U1.71(VCAP_1)
NetC5_1: C5.1 R4.1 X1.2
NetC6_1: C6.1 R5.1 X1.1
NetCN1_4: U1.102(PA10) ; port USB_ID
NetLD1_1: LD1.1(A) R6.2
NetLD2_1: LD2.1(A) R7.2
NetP1_2: U1.105(PA13(JTMS-SWDIO)) ; port TMS
NetP1_4: U1.109(PA14(JTCK-SWCLK)) ; port TCK
NetP1_7: U1.133(PB3(JTDO/TRACESWO)) ; port SWO
NetR2_2: R2.2 U1.101(PA9)
NetR15_2: U1.44(PC4) ; port RMII_RXD0
NetR16_2: U1.45(PC5) ; port RMII_RXD1
NetR23_2: U1.43(PA7) ; port RMII_CRS_DV
NetR24_1: U1.36(PA2) ; port RMII_MDIO
NetR29_2: U1.35(PA1) ; port RMII_REF_CLK
NetR50_2: U1.53(PF13) ; port PWR_SRC_STAT
NetU1_1: U1.1(PE2) ; port SPI_SCK
NetU1_3: U1.3(PE4) ; port SPI_CS
NetU1_4: U1.4(PE5) ; port SPI_MISO
NetU1_5: U1.5(PE6) ; port SPI_MOSI
NetU1_27: U1.27(PC1) ; port RMII_MDC
NetU1_74: U1.74(PB13) ; port RMII_TXD1
NetU1_126: U1.126(PG11) ; port RMII_TX_EN
NetU1_128: U1.128(PG13) ; port RMII_TXD0

Not connected (* = marked no-connect by the designer): U1 2(PE3)* 7(PC13)* 10(PF0)* 11(PF1)* 12(PF2)* 13(PF3)* 14(PF4)* 15(PF5)* 18(PF6)* 20(PF8)* 22(PF10)* 26(PC0)* 28(PC2)* 29(PC3)* 34(PA0-WKUP(PA0))* 37(PA3)* 40(PA4)* 41(PA5)* 42(PA6)* 46(PB0)* 47(PB1)* 54(PF14)* 55(PF15)* 76(PB15)* 77(PD8)* 78(PD9)* 79(PD10)* 80(PD11)* 81(PD12)* 82(PD13) 85(PD14) 86(PD15) 87(PG2)* 88(PG3)* 89(PG4)* 90(PG5)* 91(PG6)* 92(PG7)* 93(PG8) 96(PC6)* 97(PC7)* 98(PC8)* 99(PC9)* 100(PA8)* 110(PA15(JTDI))* 111(PC10)* 112(PC11)* 113(PC12)* 116(PD2)* 117(PD3)* 118(PD4)* 119(PD5)* 122(PD6)* 123(PD7)* 124(PG9)* 125(PG10)* 127(PG12)* 129(PG14)* 132(PG15)* 134(PB4(NJTRST))* 135(PB5)* 139(PB8)* 140(PB9)* 141(PE0)* 142(PE1)*

### Buses and harness runs
bus PB[10..11] = port PB[10..11]
bus PE[7..15] = port PE[7..15]
bus PF[11..13] = port PF[11..13]
bus PG[0..1] = port PG[0..1]

### Notes on the sheet
- GPIO Pins
- 13x 100nF Caps (one for each VDD pin)
  1x 4.7uF Bulk Cap
- 2x 100nF Caps (one for each AVDD pin)
  1x 1uF Bulk Cap
- DWG. NO.
- REV.
- SHT.
- THIS DOCUMENT AND THE DATA DISCLOSED HEREIN OR HEREWITH IS THE PROPERTY OF ALTIUM LIMITED AND MAY BE FREELY DISTRIBUTED IN WHOLE. NO RIGHTS ARE RESERVED OR EXPRESS OR IMPLIED WARANTEE GIVEN.
- REVISION
- DESCRIPTION
- DATE
- APPROVED
- ENG:
- APPROVALS
- PROJECT
- DSN:
- CHK:
- REFERENCE DOCUMENTS
- PROJECT REVISION:
- TITLE
- DOCUMENT REVISION:
- DESIGN ITEM:
- BOM:
- FAB DWG:
- PCB DWG:
- ASSY DWG:
- SCALE:
- SIZE
- B
- CAGE CODE
- FILE NAME
- DWG NO.
- SHEET
- OF
- REV

### Library data of the parts
B1 B2 = SW PUSHBUTTON: SE PUSHBUTTON
C1 C4 C7-C11 C13-C20 C22 C23 = Cap: Capacitor; Dielectric: X7R; Published: 8-Jun-2000; Revision: July-2002: Re-released for DXP Platform.; Publisher: Altium Limited; Value: 100n
C2 C3 = Cap_2.2uF_X7R_10%_0805: Capacitor,2.2uF,16V, X7R,10%,0805,YAGEO; Manuf_Part_1: CC0805KKX7R7BB225; Revision: July-2002: Re-released for DXP Platform.; Value: 2u2; Order: CC0805KKX7R7BB225; Manuf_1: YAGEO; Dielectric: X7R
C5 C6 C24 C25 = CAP: Capacitor; Dielectric: C0G
  C5 C6: Value: 2p0
  C24 C25: Value: 4p3
C12 = CAP SMD 0603  X5R 1µF 25V 10%: Capacitor; Rated voltage: 25V; Tolerance: 10%; Dielectric: X5R; Manufacturer: *; Manufacturer P/N: *; Order code Farnell: 1288202RL; Value: 4u7; Power: *; Temperature  Factor: *; Temperature Max: +125°C; Temperature Min: -55°C; STS Code: *
C21 = CAP SMD 0603  X5R 1µF 25V 10%: as C29 on sheet Ethernet; Manufacturer: *; Manufacturer P/N: *; Order code Farnell: 1288202RL; Value: 1u0; Power: *; Temperature  Factor: *; Temperature Max: +125°C; Temperature Min: -55°C; STS Code: *
L1 = Inductor: Value: 100uH; Published: 8-Jun-2000; Revision: July-2002: Re-released for DXP Platform.; Publisher: Altium Limited
LD1 LD2 = LED2: Typical RED, GREEN, YELLOW, AMBER GaAs LED; Published: 8-Jun-2000; Revision: July-2002: Re-released for DXP Platform.; Publisher: Altium Limited
R1 R2 = res1: Resistor; Published: 8-Jun-2000; Revision: July-2002: Re-released for DXP Platform.; Publisher: Altium Limited; Value: 10K
R3 R6 R7 = Res1: Resistor; Published: 8-Jun-2000; Revision: July-2002: Re-released for DXP Platform.; Publisher: Altium Limited
  R3: Value: 330R
  R6: Value: 1K0
  R7: Value: 680R
R4 R5 = Res1: Resistor; Value: 1K; Published: 8-Jun-2000; Revision: July-2002: Re-released for DXP Platform.; Publisher: Altium Limited
U1 = CMP-1572-00045-1: ARM Cortex-M4 32-bit MCU+FPU, 1024 KB Flash, 320 KB Internal RAM, 114 I/Os, 144-Pin LQFP, -40 to 105 degC, Tray; I/Os (High Current): 114; FLASH Size (Prog) (kB): 1024; Core: ARM Cortex-M7; Operating Frequency(F) (Processor speed) (MHz): 216; D/A Converter: 2; Internal RAM Size (kB): 320; Supply Voltage(Vcc) min (V): 1.7; DatasheetVersion: Rev. 2; ComponentLink1Description: Manufacturer URL; ComponentLink1URL: http://www.st.com/; ComponentLink2URL: http://www.st.com/st-web-ui/static/active/en/resource/technical/document/datasheet/DM00166116.pdf; Packing: Tray; Package Description: 144-Pin Low Profile Quad Flat Package, Body 20 x 20 mm, Pitch 0.5 mm; ComponentLink2Description: Datasheet; Mounting Technology: Surface Mount; Package Reference: LQFP144
X1 = CRYSTAL_32K: Crystal
X2 = XTAL: Crystal Oscillator; Published: 8-Jun-2000; LatestRevisionDate: 17-Jul-2002; LatestRevisionNote: Re-released for DXP Platform.; PackageReference: R38; Publisher: Altium Limited

## Sheet USB.SchDoc: USB
size 431 x 279 mm; Author: Alberto Marrone, Christian Schmitz, Leo Walter; DrawnBy: Alberto Marrone, Christian Schmitz, Leo Walter; Engineer: Alberto Marrone, Christian Schmitz, Leo Walter; Revision: V1.0; SheetNumber: 6; Project: PCB Design Final Project
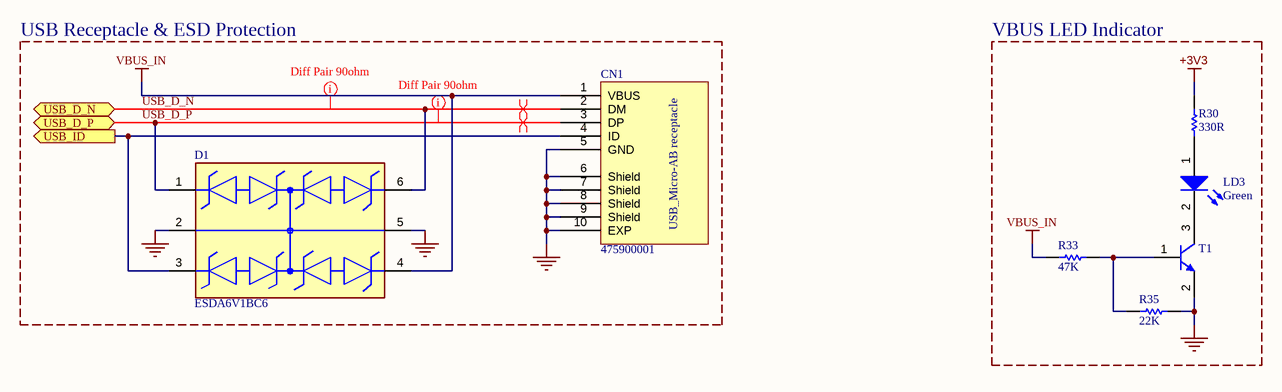
[diagram p4: USB.SchDoc]

### Parts
CN1  475900001  [MOLEX_47590001]
D1  ESDA6V1BC6  [FP-SOT23-6L-MFG]
LD3  Green  [0603D-G]
R30  330R  [0603R]
R33  47K  [0603R]
R35  22K  [0603R]
T1  MMBTA05LT3G  [SOT-23]  (value not drawn)

### Blocks framed on the sheet
USB Receptacle & ESD Protection: CN1 D1
VBUS LED Indicator: LD3 R30 R33 R35 T1

### Ports
USB_D_N (bidir), USB_D_P (bidir), USB_ID (out)

### Nets
+3V3: R30.2
GND: CN1.5(GND) CN1.6(Shield) CN1.7(Shield) CN1.8(Shield) CN1.9(Shield) CN1.10(EXP) D1.2 D1.5 R35.1 T1.2(E)
VBUS_IN: CN1.1(VBUS) D1.4 R33.1
USB_D_N: CN1.2(DM) D1.6 ; port USB_D_N
USB_D_P: CN1.3(DP) D1.1 ; port USB_D_P
NetCN1_4: CN1.4(ID) D1.3 ; port USB_ID
NetLD3_1: LD3.1(A) R30.1
NetLD3_2: LD3.2(K) T1.3(C)
NetR33_2: R33.2 R35.2 T1.1(B)

### Layout directives
net class USB_HighSpeed: USB_D_N, USB_D_P
differential pair: USB_D_N, USB_D_P

### Notes on the sheet
- DWG. NO.
- REV.
- SHT.
- THIS DOCUMENT AND THE DATA DISCLOSED HEREIN OR HEREWITH IS THE PROPERTY OF ALTIUM LIMITED AND MAY BE FREELY DISTRIBUTED IN WHOLE. NO RIGHTS ARE RESERVED OR EXPRESS OR IMPLIED WARANTEE GIVEN.
- REVISION
- DESCRIPTION
- DATE
- APPROVED
- ENG:
- APPROVALS
- PROJECT
- DSN:
- CHK:
- REFERENCE DOCUMENTS
- PROJECT REVISION:
- TITLE
- DOCUMENT REVISION:
- DESIGN ITEM:
- BOM:
- FAB DWG:
- PCB DWG:
- ASSY DWG:
- SCALE:
- SIZE
- B
- CAGE CODE
- FILE NAME
- DWG NO.
- SHEET
- OF
- REV
- (in symbol 475900001) USB_Micro-AB receptacle

### Library data of the parts
D1 = CMP-12225-000005-1: TVS DIODE 5V SOT23-6; Manufacturer: STMicroelectronics; Direction: Bidirectional; Capacitance: 20p; Standoff Height: 0mm; Number Of Channels: 4; Peak Pulse Power: 80W; Max Junction Temp: +150°C; Breakdown Voltage: 6.1V; Peak Pulse Current: 3A; Category: Diode; Manufacturer Part Number: ESDA6V1BC6; Digikey Description: TVS DIODE 5V SOT23-6; Temperature Range High: +125°C; Ipc Land Pattern Name: SOT95P280X118-6; Device Class L3: unset; Temperature Range Low: -40°C; ComponentLink2Description: Datasheet; Automotive: No; Device Class L1: Circuit Protection; Mouser Description: TVS Diodes / ESD Suppressors 6.1V 80W Bidirect; Temperature: -40°C to +125°C; Reverse Standoff Voltage: 5V; ComponentLink2URL: https://www.st.com/resource/en/datasheet/esda6v1bc6.pdf; Package: SOT23-6L; Device Class L2: TVS Diodes; Lead Free: Yes; RoHS: TRUE; Octopart: https://octopart.com/esda6v1bc6-stmicroelectronics-347715; Height: 1.45mm
LD3 = LED2: as LD1 on sheet MCU; Published: 8-Jun-2000; Revision: July-2002: Re-released for DXP Platform.; Publisher: Altium Limited
R30 = Res1: Resistor; Published: 8-Jun-2000; Revision: July-2002: Re-released for DXP Platform.; Publisher: Altium Limited; Value: 330R
R33 R35 = res1: Resistor; Published: 8-Jun-2000; Revision: July-2002: Re-released for DXP Platform.; Publisher: Altium Limited
  R33: Value: 47K
  R35: Value: 22K
T1 = NPN: NPN Bipolar Transistor; Code - JEDEC: TO-226-AA; Published: 8-Jun-2000; Revision: July-2002: Re-released for DXP Platform.; Publisher: Altium Limited

## Sheet SPI_Flash.SchDoc: SPI Flash
size 431 x 279 mm; Author: Alberto Marrone, Christian Schmitz, Leo Walter; DrawnBy: Alberto Marrone, Christian Schmitz, Leo Walter; Engineer: Alberto Marrone, Christian Schmitz, Leo Walter; Revision: V1.0; SheetNumber: 9; Project: PCB Design Final Project
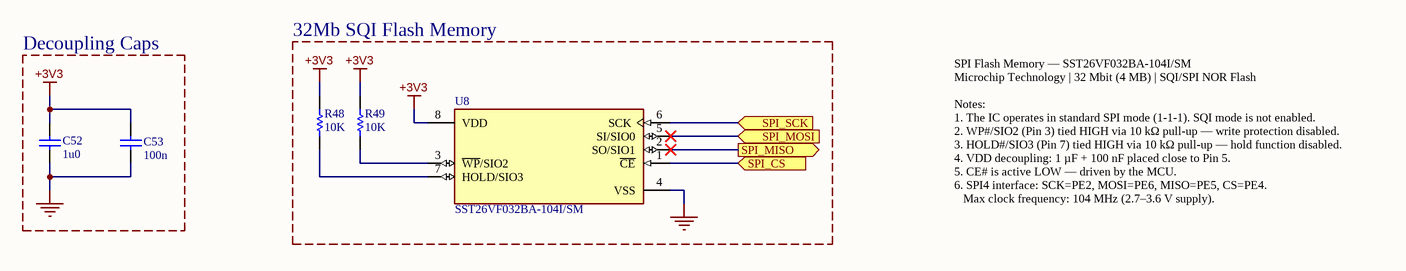
[diagram p5: SPI_Flash.SchDoc]

### Parts
C52  1u0  [0603C]
C53  100n  [0603C]
R48  10K  [0603R]
R49  10K  [0603R]
U8  SST26VF032BA-104I/SM  [FP-C04-056-IPC_A]

### Blocks framed on the sheet
Decoupling Caps: C52 C53
32Mb SQI Flash Memory: R48 R49 U8

### Ports
SPI_CS (in), SPI_MISO (out), SPI_MOSI (in), SPI_SCK (in)

### Nets
+3V3: C52.1 C53.1 R48.1 R49.1 U8.8(VDD)
GND: C52.2 C53.2 U8.4(VSS)
NetR48_2: R48.2 U8.7(HOLD/SIO3)
NetR49_2: R49.2 U8.3(~{WP}/SIO2)
NetU1_1: U8.6(SCK) ; port SPI_SCK
NetU1_3: U8.1(~{CE}) ; port SPI_CS
NetU1_4: U8.2(SO/SIO1) ; port SPI_MISO
NetU1_5: U8.5(SI/SIO0) ; port SPI_MOSI

### Notes on the sheet
- SPI Flash Memory — SST26VF032BA-104I/SM
  Microchip Technology | 32 Mbit (4 MB) | SQI/SPI NOR Flash
  Notes:
  1. The IC operates in standard SPI mode (1-1-1). SQI mode is not enabled.
  2. WP#/SIO2 (Pin 3) tied HIGH via 10 kΩ pull-up — write protection disabled.
  3. HOLD#/SIO3 (Pin 7) tied HIGH via 10 kΩ pull-up — hold function disabled.
  4. VDD decoupling: 1 µF + 100 nF placed close to Pin 5.
  5. CE# is active LOW — driven by the MCU.
  6. SPI4 interface: SCK=PE2, MOSI=PE6, MISO=PE5, CS=PE4.
  Max clock frequency: 104 MHz (2.7–3.6 V supply).
- DWG. NO.
- REV.
- SHT.
- THIS DOCUMENT AND THE DATA DISCLOSED HEREIN OR HEREWITH IS THE PROPERTY OF ALTIUM LIMITED AND MAY BE FREELY DISTRIBUTED IN WHOLE. NO RIGHTS ARE RESERVED OR EXPRESS OR IMPLIED WARANTEE GIVEN.
- REVISION
- DESCRIPTION
- DATE
- APPROVED
- ENG:
- APPROVALS
- PROJECT
- DSN:
- CHK:
- REFERENCE DOCUMENTS
- PROJECT REVISION:
- TITLE
- DOCUMENT REVISION:
- DESIGN ITEM:
- BOM:
- FAB DWG:
- PCB DWG:
- ASSY DWG:
- SCALE:
- SIZE
- B
- CAGE CODE
- FILE NAME
- DWG NO.
- SHEET
- OF
- REV

### Library data of the parts
C52 = CAP SMD 0603  X5R 1µF 25V 10%: as C29 on sheet Ethernet; Manufacturer: *; Manufacturer P/N: *; Order code Farnell: 1288202RL; Value: 1u0; Power: *; Temperature  Factor: *; Temperature Max: +125°C; Temperature Min: -55°C; STS Code: *
C53 = Cap: Capacitor; Dielectric: X7R; Published: 8-Jun-2000; Revision: July-2002: Re-released for DXP Platform.; Publisher: Altium Limited; Value: 100n
R48 R49 = res1: Resistor; Published: 8-Jun-2000; Revision: July-2002: Re-released for DXP Platform.; Publisher: Altium Limited; Value: 10K
U8 = CMP-06315-000017-1: IC FLASH 32MBIT SPI/QUAD 8SOIJ; Memory Size: 32Mb; Page Size: 256B; Operating Supply Voltage: 3V; Interface: SPI; Frequency: 104MHz; Access Time: 3ns; Min Supply Voltage: 2.7V; Max Supply Voltage: 3.6V; Memory Type: FLASH; Lead Free: Lead Free; Packaging: Rail/Tube; Length: 5.26mm; Mount: Surface Mount; Series: SST26 SQI®; Height: 1.98mm; Density: 32Mb; Number of Pins: 8; Max Operating Temperature: 85°C; Width: 5.25mm; Case/Package: SOIC; Access Time-Max: 3ns; Min Operating Temperature: -40°C; RoHS Compliant: Yes; REACH SVHC: No SVHC

## Sheet Power.SchDoc: Power
size 431 x 279 mm; Author: Alberto Marrone, Christian Schmitz, Leo Walter; DrawnBy: Alberto Marrone, Christian Schmitz, Leo Walter; Engineer: Alberto Marrone, Christian Schmitz, Leo Walter; Revision: V1.0; SheetNumber: 2; Project: PCB Design Final Project
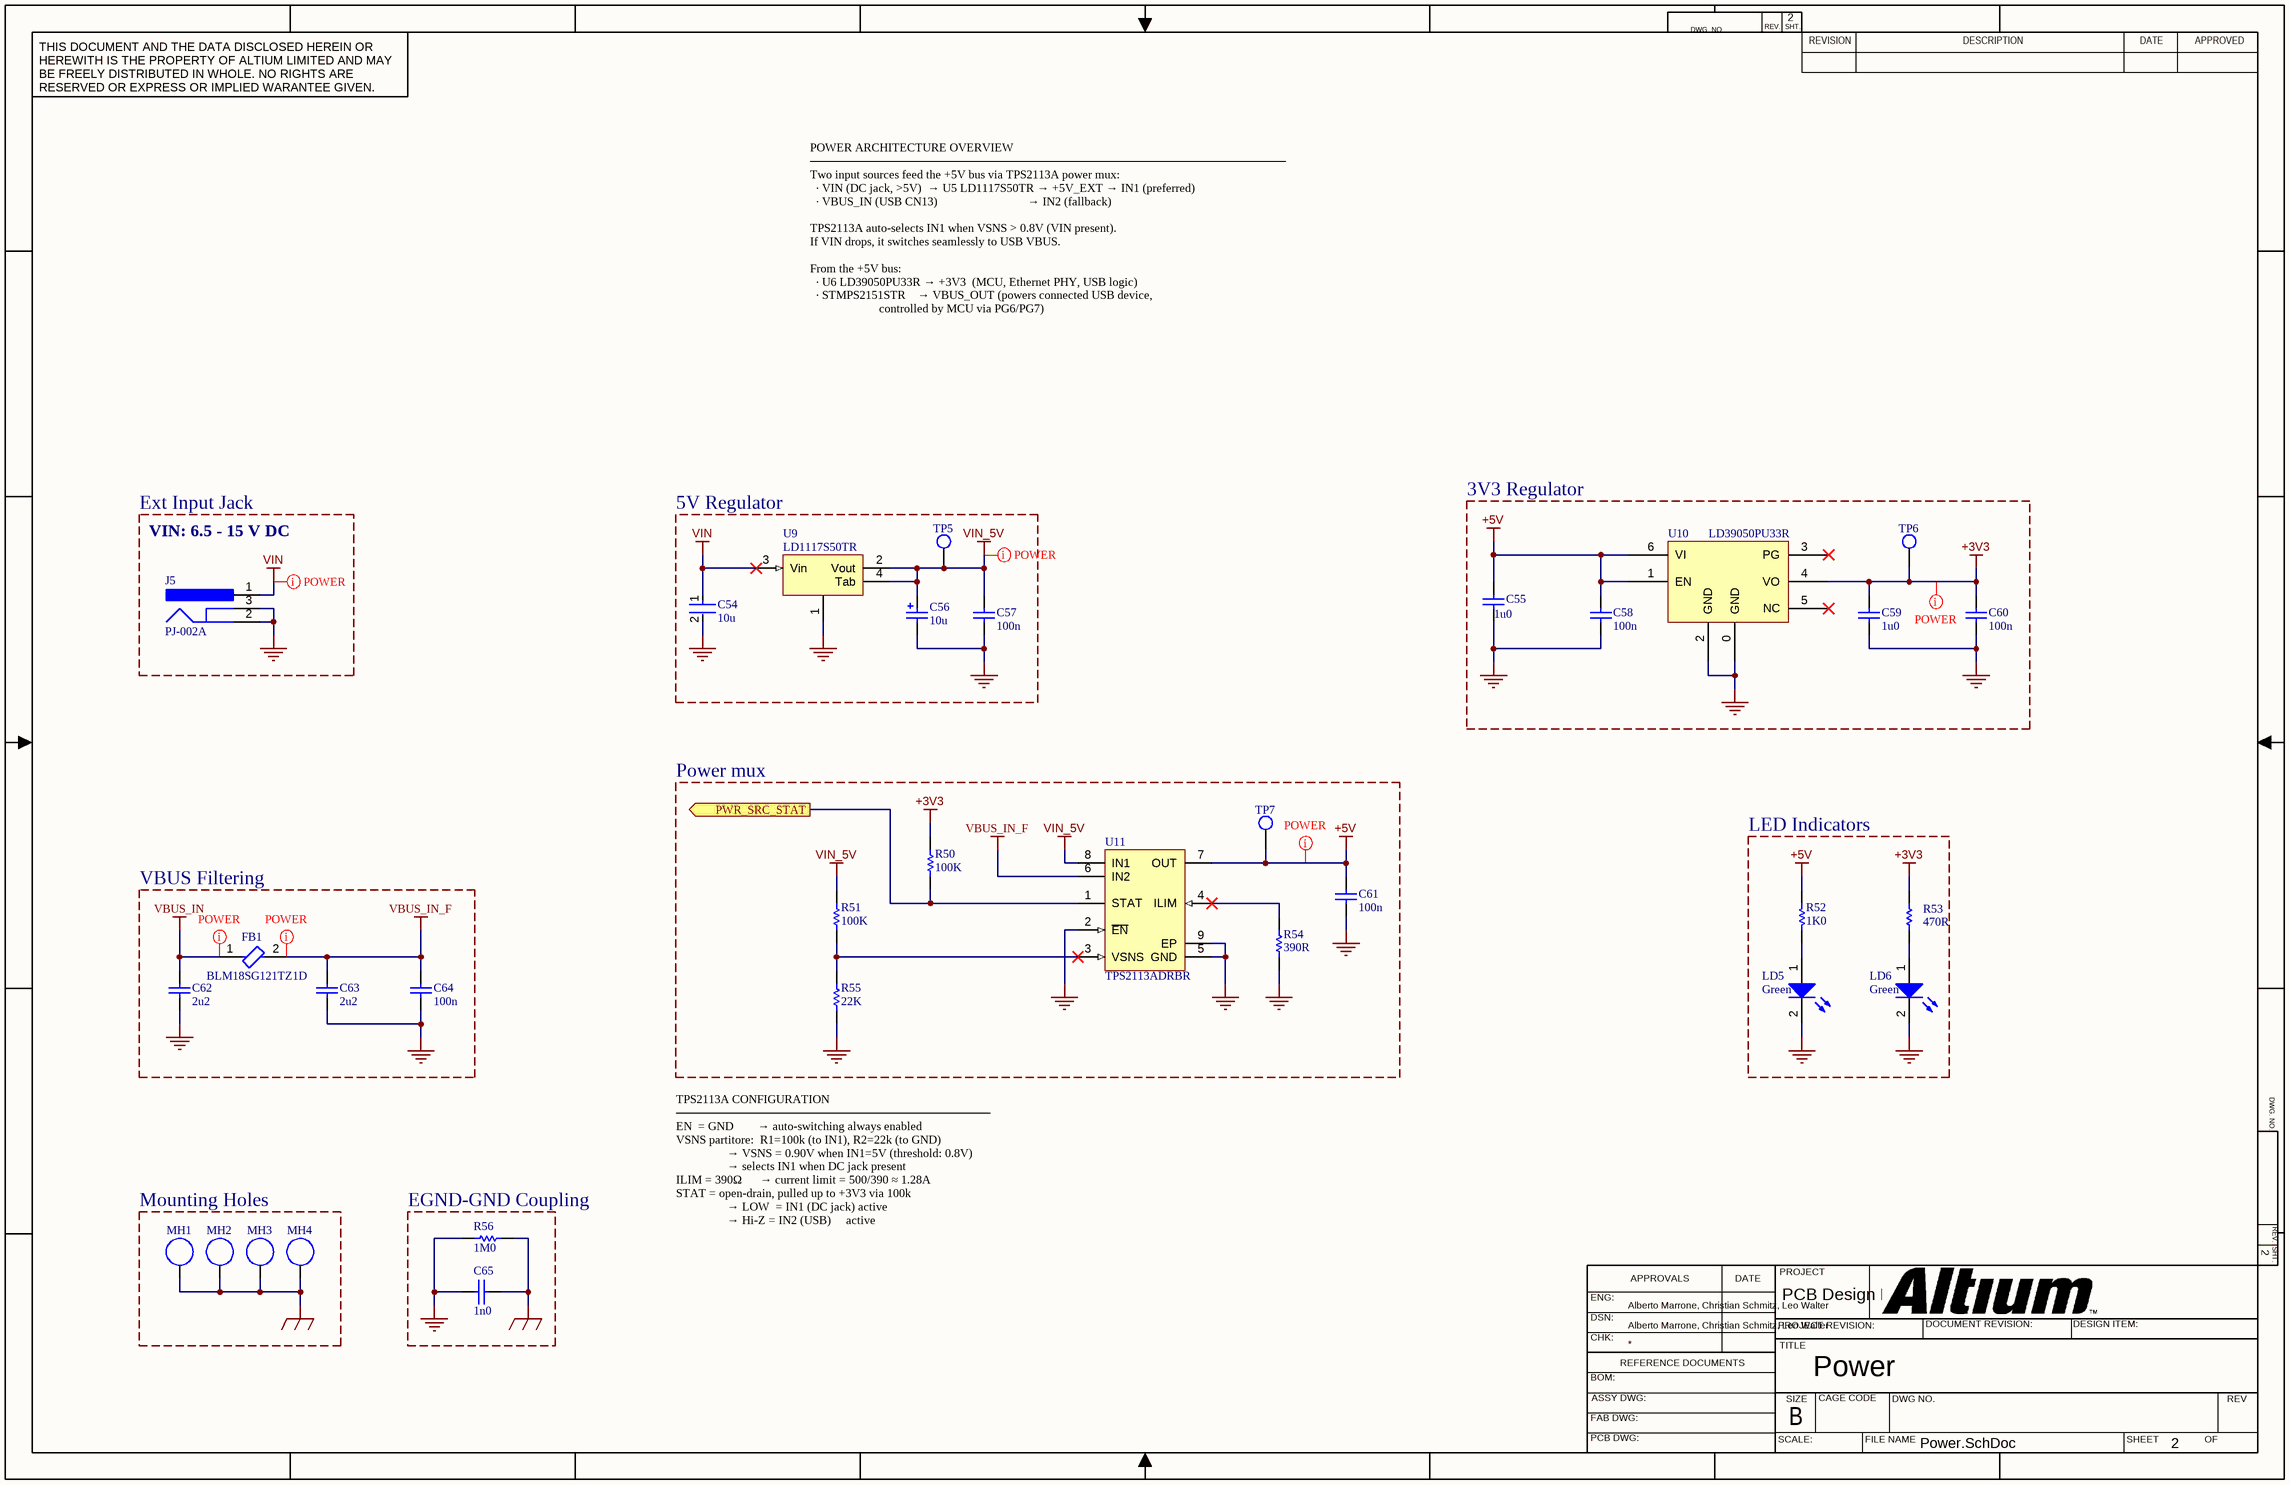
[diagram p6: Power.SchDoc]

### Parts
C54  10u  [FP-CL32-IPC_C]
C55  1u0  [0603C]
C56  10u  [TAN-B]
C57  100n  [0603C]
C58  100n  [0603C]
C59  1u0  [0603C]
C60  100n  [0603C]
C61  100n  [0603C]
C62  2u2  [TAN-A]
C63  2u2  [TAN-A]
C64  100n  [0603C]
C65  1n0  [0603C]
FB1  BLM18SG121TZ1D  [FP-BLM18-0_15-t0_5-d1_2-MFG]
J5  PJ-002A  [CUI-PJ-002A_V]
LD5  Green  [0603D-G]
LD6  Green  [0603D-G]
MH1  Mounting Hole  [MountingHole_3.5mm]  (value not drawn)  (no BOM)
MH2  Mounting Hole  [MountingHole_3.5mm]  (value not drawn)  (no BOM)
MH3  Mounting Hole  [MountingHole_3.5mm]  (value not drawn)  (no BOM)
MH4  Mounting Hole  [MountingHole_3.5mm]  (value not drawn)  (no BOM)
R50  100K  [0603R]
R51  100K  [0603R]
R52  1K0  [0603R]
R53  470R  [0603R]
R54  390R  [0603R]
R55  22K  [0603R]
R56  1M0  [0603R]
TP5  Test Point  [TP_SMD_0.8]  (value not drawn)  (no BOM)
TP6  Test Point  [TP_SMD_0.8]  (value not drawn)  (no BOM)
TP7  Test Point  [TP_SMD_0.8]  (value not drawn)  (no BOM)
U9  LD1117S50TR  [SOT-223]
U10  LD39050PU33R  [DFN6_0R95_3x3_TP]
U11  TPS2113ADRBR  [DRB0008B_V]

### Blocks framed on the sheet
Ext Input Jack: J5
5V Regulator: C54 C56 C57 TP5 U9
3V3 Regulator: C55 C58-C60 TP6 U10
Power mux: C61 R50 R51 R54 R55 TP7 U11
LED Indicators: LD5 LD6 R52 R53
VBUS Filtering: C62-C64 FB1
Mounting Holes: MH1-MH4
EGND-GND Coupling: C65 R56

### Ports
PWR_SRC_STAT (out)

### Nets
+3V3: C59.1 C60.2 R50.1 R53.2 TP6.1 U10.4(VO)
+5V: C55.1 C58.2 C61.2 R52.2 TP7.1 U10.1(EN) U10.6(VI) U11.7(OUT)
EGND: C65.2 MH1.1 MH2.1 MH3.1 MH4.1 R56.2
GND: C54.2 C55.2 C56.2 C57.1 C58.1 C59.2 C60.1 C61.1 C62.2 C63.2 C64.1 C65.1 J5.2 J5.3 LD5.2(K) LD6.2(K) R54.2 R55.2 R56.1 U9.1 U10.0(GND) U10.2(GND) U11.2(~{EN}) U11.5(GND) U11.9(EP)
VBUS_IN: C62.1 FB1.1
VBUS_IN_F: C63.1 C64.2 FB1.2 U11.6(IN2)
VIN: C54.1 J5.1 U9.3(Vin)
VIN_5V: C56.1 C57.2 R51.1 TP5.1 U9.2(Vout) U9.4(Tab) U11.8(IN1)
NetLD5_1: LD5.1(A) R52.1
NetLD6_1: LD6.1(A) R53.1
NetR50_2: R50.2 U11.1(STAT) ; port PWR_SRC_STAT
NetR51_2: R51.2 R55.1 U11.3(VSNS)
NetR54_1: R54.1 U11.4(ILIM)

Not connected (* = marked no-connect by the designer): U10 3(PG)* 5(NC)*

### Layout directives
net class POWER: +3V3, +5V, VBUS_IN, VBUS_IN_F, VIN, VIN_5V

### Notes on the sheet
- POWER ARCHITECTURE OVERVIEW
  ────────────────────────────────────────────────────────
  Two input sources feed the +5V bus via TPS2113A power mux:
  · VIN (DC jack, >5V)  → U5 LD1117S50TR → +5V_EXT → IN1 (preferred)
  · VBUS_IN (USB CN13)                              → IN2 (fallback)
  TPS2113A auto-selects IN1 when VSNS > 0.8V (VIN present).
  If VIN drops, it switches seamlessly to USB VBUS.
  From the +5V bus:
  · U6 LD39050PU33R → +3V3  (MCU, Ethernet PHY, USB logic)
  · STMPS2151STR    → VBUS_OUT (powers connected USB device,
  controlled by MCU via PG6/PG7)
- VIN: 6.5 - 15 V DC
- TPS2113A CONFIGURATION
  ─────────────────────────────────────
  EN  = GND        → auto-switching always enabled
  VSNS partitore:  R1=100k (to IN1), R2=22k (to GND)
  → VSNS = 0.90V when IN1=5V (threshold: 0.8V)
  → selects IN1 when DC jack present
  ILIM = 390Ω      → current limit = 500/390 ≈ 1.28A
  STAT = open-drain, pulled up to +3V3 via 100k
  → LOW  = IN1 (DC jack) active
  → Hi-Z = IN2 (USB)     active
- DWG. NO.
- REV.
- SHT.
- THIS DOCUMENT AND THE DATA DISCLOSED HEREIN OR HEREWITH IS THE PROPERTY OF ALTIUM LIMITED AND MAY BE FREELY DISTRIBUTED IN WHOLE. NO RIGHTS ARE RESERVED OR EXPRESS OR IMPLIED WARANTEE GIVEN.
- REVISION
- DESCRIPTION
- DATE
- APPROVED
- ENG:
- APPROVALS
- PROJECT
- DSN:
- CHK:
- REFERENCE DOCUMENTS
- PROJECT REVISION:
- TITLE
- DOCUMENT REVISION:
- DESIGN ITEM:
- BOM:
- FAB DWG:
- PCB DWG:
- ASSY DWG:
- SCALE:
- SIZE
- B
- CAGE CODE
- FILE NAME
- DWG NO.
- SHEET
- OF
- REV

### Library data of the parts
C54 = CMP-2000-06110-2: Cap Ceramic 10uF 50V X7R ±10% SMD 1210 +125°C Embossed T/R; Material: Ceramic; Min Operating Temperature: -55°C; Depth: 2.5mm; Radiation Hardening: No; Value: 10u; Packaging: Tape and Reel; Dielectric: X7R; Case Code (Metric): 3225; Height: 2.5mm; Thickness: 0.106inch; Voltage Rating (DC): 50V; Voltage Rating: 50V; Width: 0.098inch; Case Code (Imperial): 1210; Length: 3.2mm; Tolerance: 10%; Lead Free: Lead Free; Package Quantity: 1; Voltage: 50V; Mount: Surface Mount; Case/Package: 1210; Max Operating Temperature: 125°C
C55 C59 = CAP SMD 0603  X5R 1µF 25V 10%: as C29 on sheet Ethernet; Manufacturer: *; Manufacturer P/N: *; Order code Farnell: 1288202RL; Value: 1u0; Power: *; Temperature  Factor: *; Temperature Max: +125°C; Temperature Min: -55°C; STS Code: *
C56 = Cap Pol1: Tantalum Capacitor; Voltage Rating: 25V; Published: 8-Jun-2000; Revision: July-2002: Re-released for DXP Platform.; Publisher: Altium Limited; Value: 10u
C57 C58 C60 C61 C64 = Cap: Capacitor; Dielectric: X7R; Published: 8-Jun-2000; Revision: July-2002: Re-released for DXP Platform.; Publisher: Altium Limited; Value: 100n
C62 C63 = Cap_2.2uF_X7R_10%_0805: as C2 on sheet MCU; Revision: July-2002: Re-released for DXP Platform.; Value: 2u2; Order: CC0805KKX7R7BB225; Manuf_1: YAGEO; Dielectric: X7R
C65 = CAP: Capacitor; Voltage: 50V; Dielectric: C0G; Value: 1n0
FB1 = CMP-06046-001168-2: Chip Ferrite Bead, 0603, 120Ω @ 100MHz, 25%, 0.025Ω, 3A; Number of Lines: 1; DC Resistance (DCR): 25mR; Max Current Rating: 3A; Min Operating Temperature: -55°C; Max Operating Temperature: 125°C; Ratings: AEC-Q200; RoHS Compliant: Yes; Case Code (Metric): 1608; Mount: Surface Mount; Case Code (Imperial): 0603; Packaging: Cut Tape; Case/Package: 0603
J5 = CMP-2000-06895-2: Through Hole Right Angle DC Power Jack, 2.5 A, 2 mm Center Pin, 3 Position, -25 to 85 degC, RoHS, Bulk; Manufacturer: CUIInc.; Brand: CUI; Inside Contact Diameter: 2mm; Voltage Rating: 24V; Outside Contact Diameter: 6.5mm; Current Rating: 2.5A; Insulation Resistance: 50MOhms; Contact Gender: Male; Connector Type: DCPowerJack; Datasheet Version: Rev. 1.03, 04/2016; Housing Material: PolybutyleneTerephthalate(PBT); Operating Temperature Range: -25Cto+85C; Termination Style: ThroughHole; Product Category: DCPowerConnectors; Mounting Technology: ThroughHole; Mounting Style: ThroughHole; Factory Pack Quantity: 500; Contact Plating: Nickel; Package Reference: PJ-002A; Mounting Angle: Right; Package Description: 3-Pin Through Hole Device, Body 14.4 x 9 mm, Height 11 mm; Flammability Rating: UL94V-0; Manufacturer URL: http://www.cui.com/; Product: Jacks; Contact Material: Copper; Datasheet URL: http://www.cui.com/product/resource/pj-002a.pdf; RoHS: True
LD5 LD6 = LED2: as LD1 on sheet MCU; Published: 8-Jun-2000; Revision: July-2002: Re-released for DXP Platform.; Publisher: Altium Limited
MH1-MH4 = MountingHole
R50 R51 R54 R55 = res1: Resistor; Published: 8-Jun-2000; Revision: July-2002: Re-released for DXP Platform.; Publisher: Altium Limited
  R50 R51: Value: 100K
  R54: Value: 390R
  R55: Value: 22K
R52 = Res1: Resistor; Published: 8-Jun-2000; Revision: July-2002: Re-released for DXP Platform.; Publisher: Altium Limited; Value: 1K0
R53 = Resistor_ST: Resistor 0402 / 0603 / 0805; Value: 470R
R56 = Res1: Resistor; Ordered by: Subcon; Published: 8-Jun-2000; Revision: July-2002: Re-released for DXP Platform.; Publisher: Altium Limited; Value: 1M0
TP5-TP7 = Test_Point
U9 = LD1117
U10 = LD39050P
U11 = CMP-0339-00015-2: Dual In / Single Out Autoswitching Power Mux, 2.8 to 5.5 V, -40 to 85 degC, 9-pin SON (DRB), Green (RoHS & no Sb/Br); Manufacturer: Texas Instruments; IN1, IN2 Input Voltage(Min)(V): 2.8; SubFamily: Power Multiplexer (MUX); IN1 rDS(on)(Typ)(mOhm): 84; IN2 rDS(on)(Typ)(Ohms): 0.084; Number of Inputs: 2; IN1, IN2 Input Voltage(Max)(V): 5.5; IN2 Output Current(Max)(A): 1.25; PackageVersion: revK, Jun-2012; PackageDescription: 8-Pin Plastic Small Outline No-Lead, 3 x 3 x 1 mm Body, 0.65 mm Pitch, Exposed Pad; ComponentLink1Description: Datasheet; ComponentLink1URL: http://www.ti.com/general/docs/lit/getliterature.tsp?genericPartNumber=TPS2113A&fileType=pdf; DatasheetVersion: SBVS045C; Eco-Plan: Green (RoHS & no Sb/Br); PartNumber: TPS2113ADRBR; Mounting Technology: Surface Mount; PackageReference: DRB0008B; IN1 Output Current(Max)(A): 1.25

## Sheet CAN.SchDoc: CAN
size 431 x 279 mm; Author: Alberto Marrone, Christian Schmitz, Leo Walter; DrawnBy: Alberto Marrone, Christian Schmitz, Leo Walter; Engineer: Alberto Marrone, Christian Schmitz, Leo Walter; Revision: V1.0; SheetNumber: 3; Project: PCB Design Final Project
Used 2 times, as channels CAN1, CAN2. Parts and nets are listed once, with the designators drawn on the sheet.
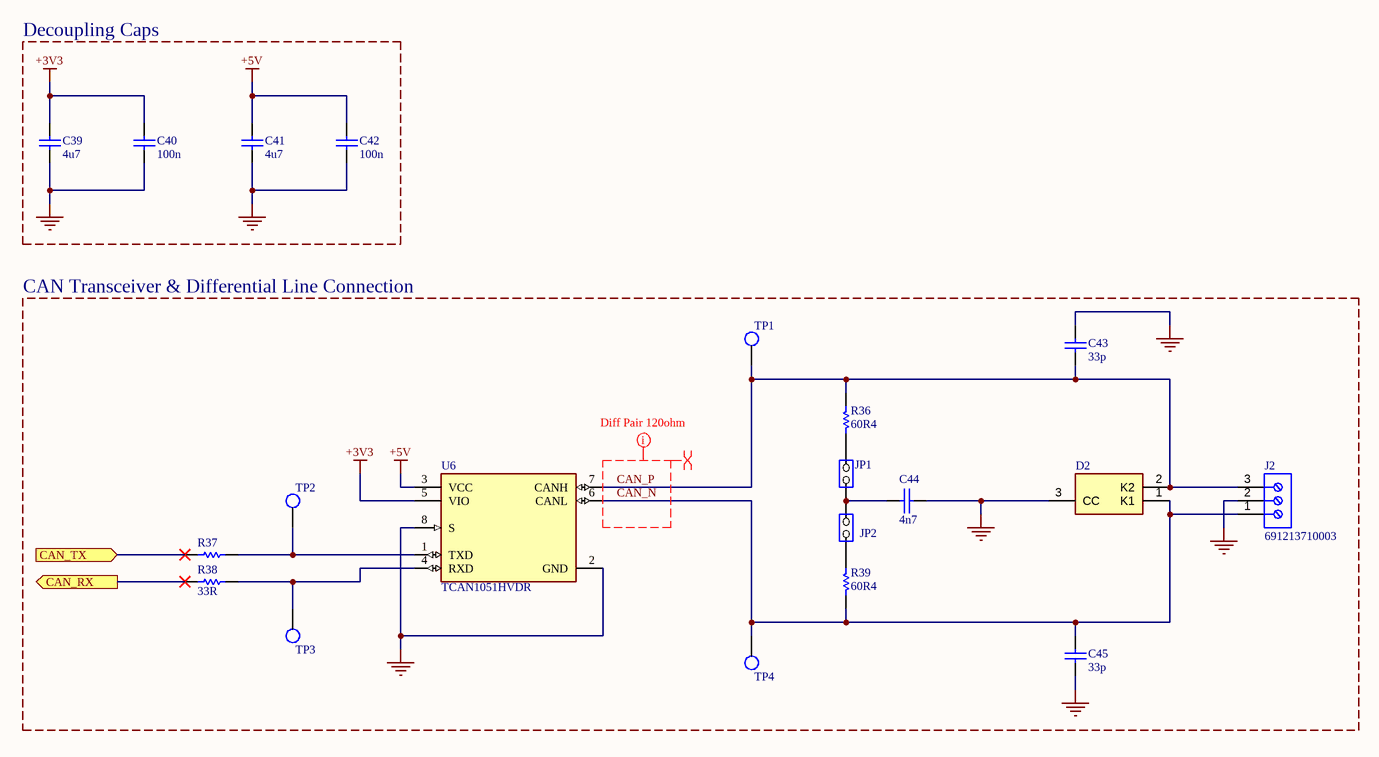
[diagram p7: CAN.SchDoc]

### Parts
C39  4u7  [0603C]
C40  100n  [0603C]
C41  4u7  [0603C]
C42  100n  [0603C]
C43  33p  [0603C]
C44  4n7  [0603C]
C45  33p  [0603C]
D2  PESD2CANFD24LT-QR  [SOT95P230X110-3N]  (value not drawn)
J2  691213710003  [691213710003]
JP1  (no value)  [HDR_1x2_2R54_V_M_S]
JP2  (no value)  [HDR_1x2_2R54_V_M_S]
R36  60R4  [0603R]
R37  33R  [0603R]  (value not drawn)
R38  33R  [0603R]
R39  60R4  [0603R]
TP1  Test Point  [TP_SMD_0.8]  (value not drawn)  (no BOM)
TP2  Test Point  [TP_SMD_0.8]  (value not drawn)  (no BOM)
TP3  Test Point  [TP_SMD_0.8]  (value not drawn)  (no BOM)
TP4  Test Point  [TP_SMD_0.8]  (value not drawn)  (no BOM)
U6  TCAN1051HVDR  [FP-D0008B-IPC_B]

### Blocks framed on the sheet
Decoupling Caps: C39-C42
CAN Transceiver & Differential Line Connection: C43-C45 D2 J2 JP1 JP2 R36-R39 TP1-TP4 U6

### Ports
CAN_RX (out), CAN_TX (in)

### Nets
+3V3: C39.1 C40.1 U6.5(VIO)
+5V: C41.1 C42.1 U6.3(VCC)
GND: C39.2 C40.2 C41.2 C42.2 C43.2 C44.2 C45.1 D2.3(CC) J2.2 U6.2(GND) U6.8(S)
CAN_N: C45.2 D2.1(K1) J2.1 R39.1 TP4.1 U6.6(CANL)
CAN_P: C43.1 D2.2(K2) J2.3 R36.2 TP1.1 U6.7(CANH)
CAN_RX: R38.1 ; port CAN_RX
CAN_TX: R37.1 ; port CAN_TX
NetC44_1: C44.1 JP1.1(COMMON) JP2.2(NO)
NetJP1_2: JP1.2(NO) R36.1
NetJP2_1: JP2.1(COMMON) R39.2
NetR37_2: R37.2 TP2.1 U6.1(TXD)
NetR38_2: R38.2 TP3.1 U6.4(RXD)

### Channels
CAN1: designators end in _1; ports CAN_RX=CAN1_RX CAN_TX=CAN1_TX
CAN2: designators end in _2; ports CAN_RX=CAN2_RX CAN_TX=CAN2_TX

### Layout directives
differential pair: CAN_N, CAN_P
net class CAN_Diff: CAN_N, CAN_P

### Notes on the sheet
- DWG. NO.
- REV.
- SHT.
- THIS DOCUMENT AND THE DATA DISCLOSED HEREIN OR HEREWITH IS THE PROPERTY OF ALTIUM LIMITED AND MAY BE FREELY DISTRIBUTED IN WHOLE. NO RIGHTS ARE RESERVED OR EXPRESS OR IMPLIED WARANTEE GIVEN.
- REVISION
- DESCRIPTION
- DATE
- APPROVED
- ENG:
- APPROVALS
- PROJECT
- DSN:
- CHK:
- REFERENCE DOCUMENTS
- PROJECT REVISION:
- TITLE
- DOCUMENT REVISION:
- DESIGN ITEM:
- BOM:
- FAB DWG:
- PCB DWG:
- ASSY DWG:
- SCALE:
- SIZE
- B
- CAGE CODE
- FILE NAME
- DWG NO.
- SHEET
- OF
- REV

### Library data of the parts
C39 C41 = CAP SMD 0603  X5R 1µF 25V 10%: as C12 on sheet MCU; Manufacturer: *; Manufacturer P/N: *; Order code Farnell: 1288202RL; Value: 4u7; Power: *; Temperature  Factor: *; Temperature Max: +125°C; Temperature Min: -55°C; STS Code: *
C40 C42 = Cap: Capacitor; Dielectric: X7R; Published: 8-Jun-2000; Revision: July-2002: Re-released for DXP Platform.; Publisher: Altium Limited; Value: 100n
C43 C45 = Cap: Capacitor; Dielectric: C0G; Published: 8-Jun-2000; Revision: July-2002: Re-released for DXP Platform.; Publisher: Altium Limited; Value: 33p; Supplier 1: DigiKey; Supplier Part Number 1: 720-1913-1-ND
C44 = CAP: Capacitor; Dielectric: C0G; Value: 4n7; Supplier 1: Arrow Electronics; Supplier Part Number 1: C0603C472K5GACTU
D2 = PESD2CANFD24LT-QR: vp_PESD2CANFD24LT-Q - ESD protection for In-vehicle networks@en-us; Manufacturer_Name: Nexperia; Geometry.Height: 1.1mm; Manufacturer_Part_Number: PESD2CANFD24LT-QR; Mouser Part Number: 771-PESD2CANFD24LTQR; Mouser Price/Stock: https://www.mouser.co.uk/ProductDetail/Nexperia/PESD2CANFD24LT-QR?qs=vvQtp7zwQdPkdQ8USTElVw%3D%3D; Arrow Part Number: PESD2CANFD24LT-QR; Arrow Price/Stock: https://www.arrow.com/en/products/pesd2canfd24lt-qr/nexperia?utm_currency=USD&region=europe; Datasheet Link: https://assets.nexperia.com/documents/data-sheet/PESD2CANFD24LT-Q.pdf
J2 = CMP-1502-02527-3: 213 Series 5MM Pitch Straight, Pcb Terminal Block, Through Hole, 3 Way; Stripping Length: -7mm; Wire Gauge (Max): 26AWG; Pitch: 5.0038mm; Voltage: 300V; Current: 10A; Wire/Cable Gauge: 16AWG; Connector Type: PCB, Terminal Block; Plating: Brass, Steel; Number of Positions Per Level: 3; Number of Levels: 1; Height: 10mm; Housing Material: Nylon; Termination: Screw; RoHS: Compliant; Max Operating Temperature: 105°C; Contact Plating: Tin; Contact Material: Brass; Number of Pins: 3; Color: Green; Length: 8.3mm; REACH SVHC: Unknown; Packaging: Box; Wire Gauge (Min): 16AWG; Min Operating Temperature: -40°C; Lead Pitch: 5mm; Number of Contacts: 3; Width: 15.6mm; Mount: Through Hole
JP1 JP2 = JP2
R36 R39 = res1: Resistor; Published: 8-Jun-2000; Revision: July-2002: Re-released for DXP Platform.; Publisher: Altium Limited; Value: 60R4; Supplier 1: Farnell; Supplier Part Number 1: CRCW060360R4FKTA
R37 R38 = res1: Resistor; Tolerance: 1%; Published: 8-Jun-2000; Revision: July-2002: Re-released for DXP Platform.; Publisher: Altium Limited; Value: 33R
TP1-TP4 = Test_Point
U6 = CMP-04872-000066-1: IC TRANSCEIVER HALF 1/1 8SOIC; Min Supply Voltage: 4.5V; Max Supply Voltage: 5.5V; Interface: CAN; Min Operating Temperature: -55°C; Packaging: Cut Tape; Case/Package: SOIC; Max Operating Temperature: 125°C; RoHS Compliant: Yes; REACH SVHC: No SVHC; Number of Pins: 8; Lead Free: Lead Free

## Sheet ADC.SchDoc: ADC
size 431 x 279 mm; Author: Alberto Marrone, Christian Schmitz, Leo Walter; DrawnBy: Alberto Marrone, Christian Schmitz, Leo Walter; Engineer: Alberto Marrone, Christian Schmitz, Leo Walter; Revision: V1.0; SheetNumber: 4; Project: PCB Design Final Project
Used 2 times, as channels U_ADC, U_ADC. Parts and nets are listed once, with the designators drawn on the sheet.
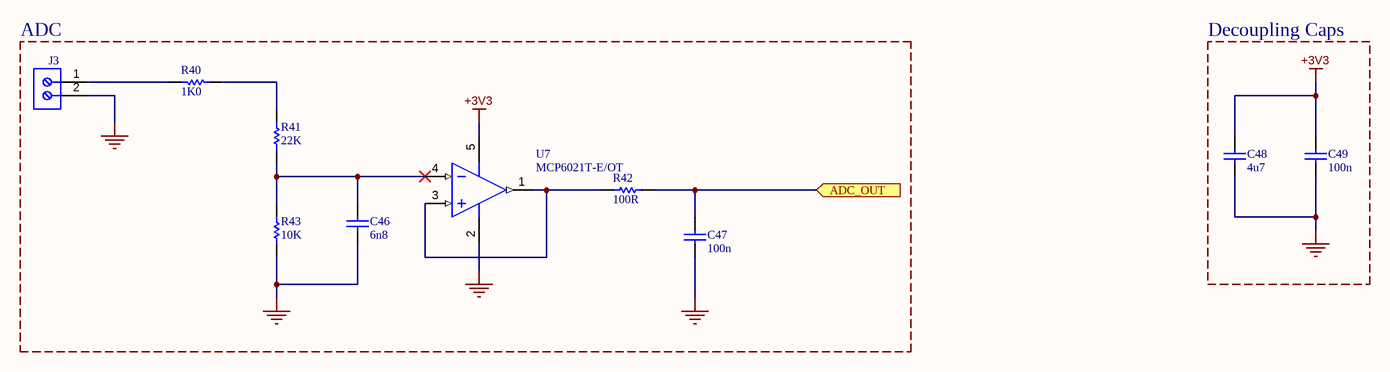
[diagram p8: ADC.SchDoc]

### Parts
C46  6n8  [0603C]
C47  100n  [0603C]
C48  4u7  [0603C]
C49  100n  [0603C]
J3  691213710002  [691213710002]  (value not drawn)
R40  1K0  [0603R]
R41  22K  [0603R]
R42  100R  [0603R]
R43  10K  [0603R]
U7  MCP6021T-E/OT  [SOT-23-OT5_N]

### Blocks framed on the sheet
ADC: C46 C47 J3 R40-R43 U7
Decoupling Caps: C48 C49

### Ports
ADC_OUT (in)

### Nets
+3V3: C48.1 C49.2 U7.5(VDD)
GND: C46.1 C47.1 C48.2 C49.1 J3.2 R43.1 U7.2(VSS)
ADC_OUT: C47.2 R42.1 ; port ADC_OUT
NetC46_2: C46.2 R41.1 R43.2 U7.4(VIN-)
NetJ3_1: J3.1 R40.1
NetR40_2: R40.2 R41.2
NetR42_2: R42.2 U7.1(VOUT) U7.3(VIN+)

### Channels
U_ADC: designators end in _1; ports ADC_OUT=ADC_CH1
U_ADC: designators end in _2; ports ADC_OUT=ADC_CH2

### Notes on the sheet
- DWG. NO.
- REV.
- SHT.
- THIS DOCUMENT AND THE DATA DISCLOSED HEREIN OR HEREWITH IS THE PROPERTY OF ALTIUM LIMITED AND MAY BE FREELY DISTRIBUTED IN WHOLE. NO RIGHTS ARE RESERVED OR EXPRESS OR IMPLIED WARANTEE GIVEN.
- REVISION
- DESCRIPTION
- DATE
- APPROVED
- ENG:
- APPROVALS
- PROJECT
- DSN:
- CHK:
- REFERENCE DOCUMENTS
- PROJECT REVISION:
- TITLE
- DOCUMENT REVISION:
- DESIGN ITEM:
- BOM:
- FAB DWG:
- PCB DWG:
- ASSY DWG:
- SCALE:
- SIZE
- B
- CAGE CODE
- FILE NAME
- DWG NO.
- SHEET
- OF
- REV

### Library data of the parts
C46 = Capacitor_ST: Capacitor 0402 / 0603 / 0805; Voltage Rating: 50 V; Dielectric: C0G; Revision: July-2002: Re-released for DXP Platform.; Value: 6n8
C47 C49 = Cap: Capacitor; Dielectric: X7R; Published: 8-Jun-2000; Revision: July-2002: Re-released for DXP Platform.; Publisher: Altium Limited; Value: 100n
C48 = CAP SMD 0603  X5R 1µF 25V 10%: as C12 on sheet MCU; Manufacturer: *; Manufacturer P/N: *; Order code Farnell: 1288202RL; Value: 4u7; Power: *; Temperature  Factor: *; Temperature Max: +125°C; Temperature Min: -55°C; STS Code: *
J3 = CMP-1502-02526-3: 213 Series 5MM Pitch Straight, Pcb Terminal Block, Through Hole, 2 Way; Voltage: 300V; Number of Positions Per Level: 2; Pitch: 5.0038mm; Current: 10A; Plating: Brass, Steel; Wire Gauge (Min): 16AWG; Wire Gauge (Max): 26AWG; Stripping Length: -7mm; Number of Levels: 1; RoHS: Compliant; Contact Plating: Tin; Height: 10mm; Contact Material: Brass; Width: 10.6mm; Packaging: Box; Housing Material: Nylon; Mount: Through Hole; Max Operating Temperature: 105°C; Color: Green; Lead Pitch: 5mm; Voltage Rating: 300V; Min Operating Temperature: -40°C; Current Rating: 10A; Termination: Screw; Number of Pins: 2; Number of Contacts: 2; Length: 8.3mm; Wire/Cable Gauge: 26AWG
R40 = Res1: Resistor; Published: 8-Jun-2000; Revision: July-2002: Re-released for DXP Platform.; Publisher: Altium Limited; Value: 1K0
R41-R43 = res1: Resistor; Published: 8-Jun-2000; Revision: July-2002: Re-released for DXP Platform.; Publisher: Altium Limited
  R41: Value: 22K
  R42: Value: 100R
  R43: Value: 10K
U7 = CMP-0187-00449-3: None; Nominal Supply Current: 1mA; Gain Bandwidth Product: 10MHz; Input Bias Current: 1pA; Max Supply Voltage: 5.5V; Min Input Voltage: 2.5V; Voltage Gain: 110dB; Number of Circuits: 1; Slew Rate: 7V/µs; Input Offset Voltage (Vos): 250uV; Power Supply Rejection Ratio (PSRR): 74dB; Input Offset Voltage-Max: 500uV; Output Current per Channel: 30mA; Output Current: 22mA; Common Mode Rejection Ratio: 70dB; Max Frequency: 10kHz; Amplifier Type: GENERAL PURPOSE; Contact Plating: Tin; Number of Pins: 5; Operating Supply Current: 1mA; RoHS Compliant: Yes; Mount: Surface Mount; Number of Amplifiers: 1; Case/Package: SOT-23; Min Supply Voltage: 2.5V; Radiation Hardening: No; Height: 0.051inch; Max Input Voltage: 5.5V; Min Operating Temperature: -40°C; Max Operating Temperature: 125°C; Number of Channels: 1; Package Quantity: 3000; Unity Gain Bandwidth Product: 10MHz; Length: 0.122inch; Width: 0.071inch; Number of Elements: 1; Bandwidth: 10MHz; Lead Free: Lead Free; Packaging: Tape and Reel; Technology: CMOS; Supply Current: 1mA; REACH SVHC: No SVHC